# EAGLE design DIS08070H-V2.0-20231204 (EAGLE 9.5.1)
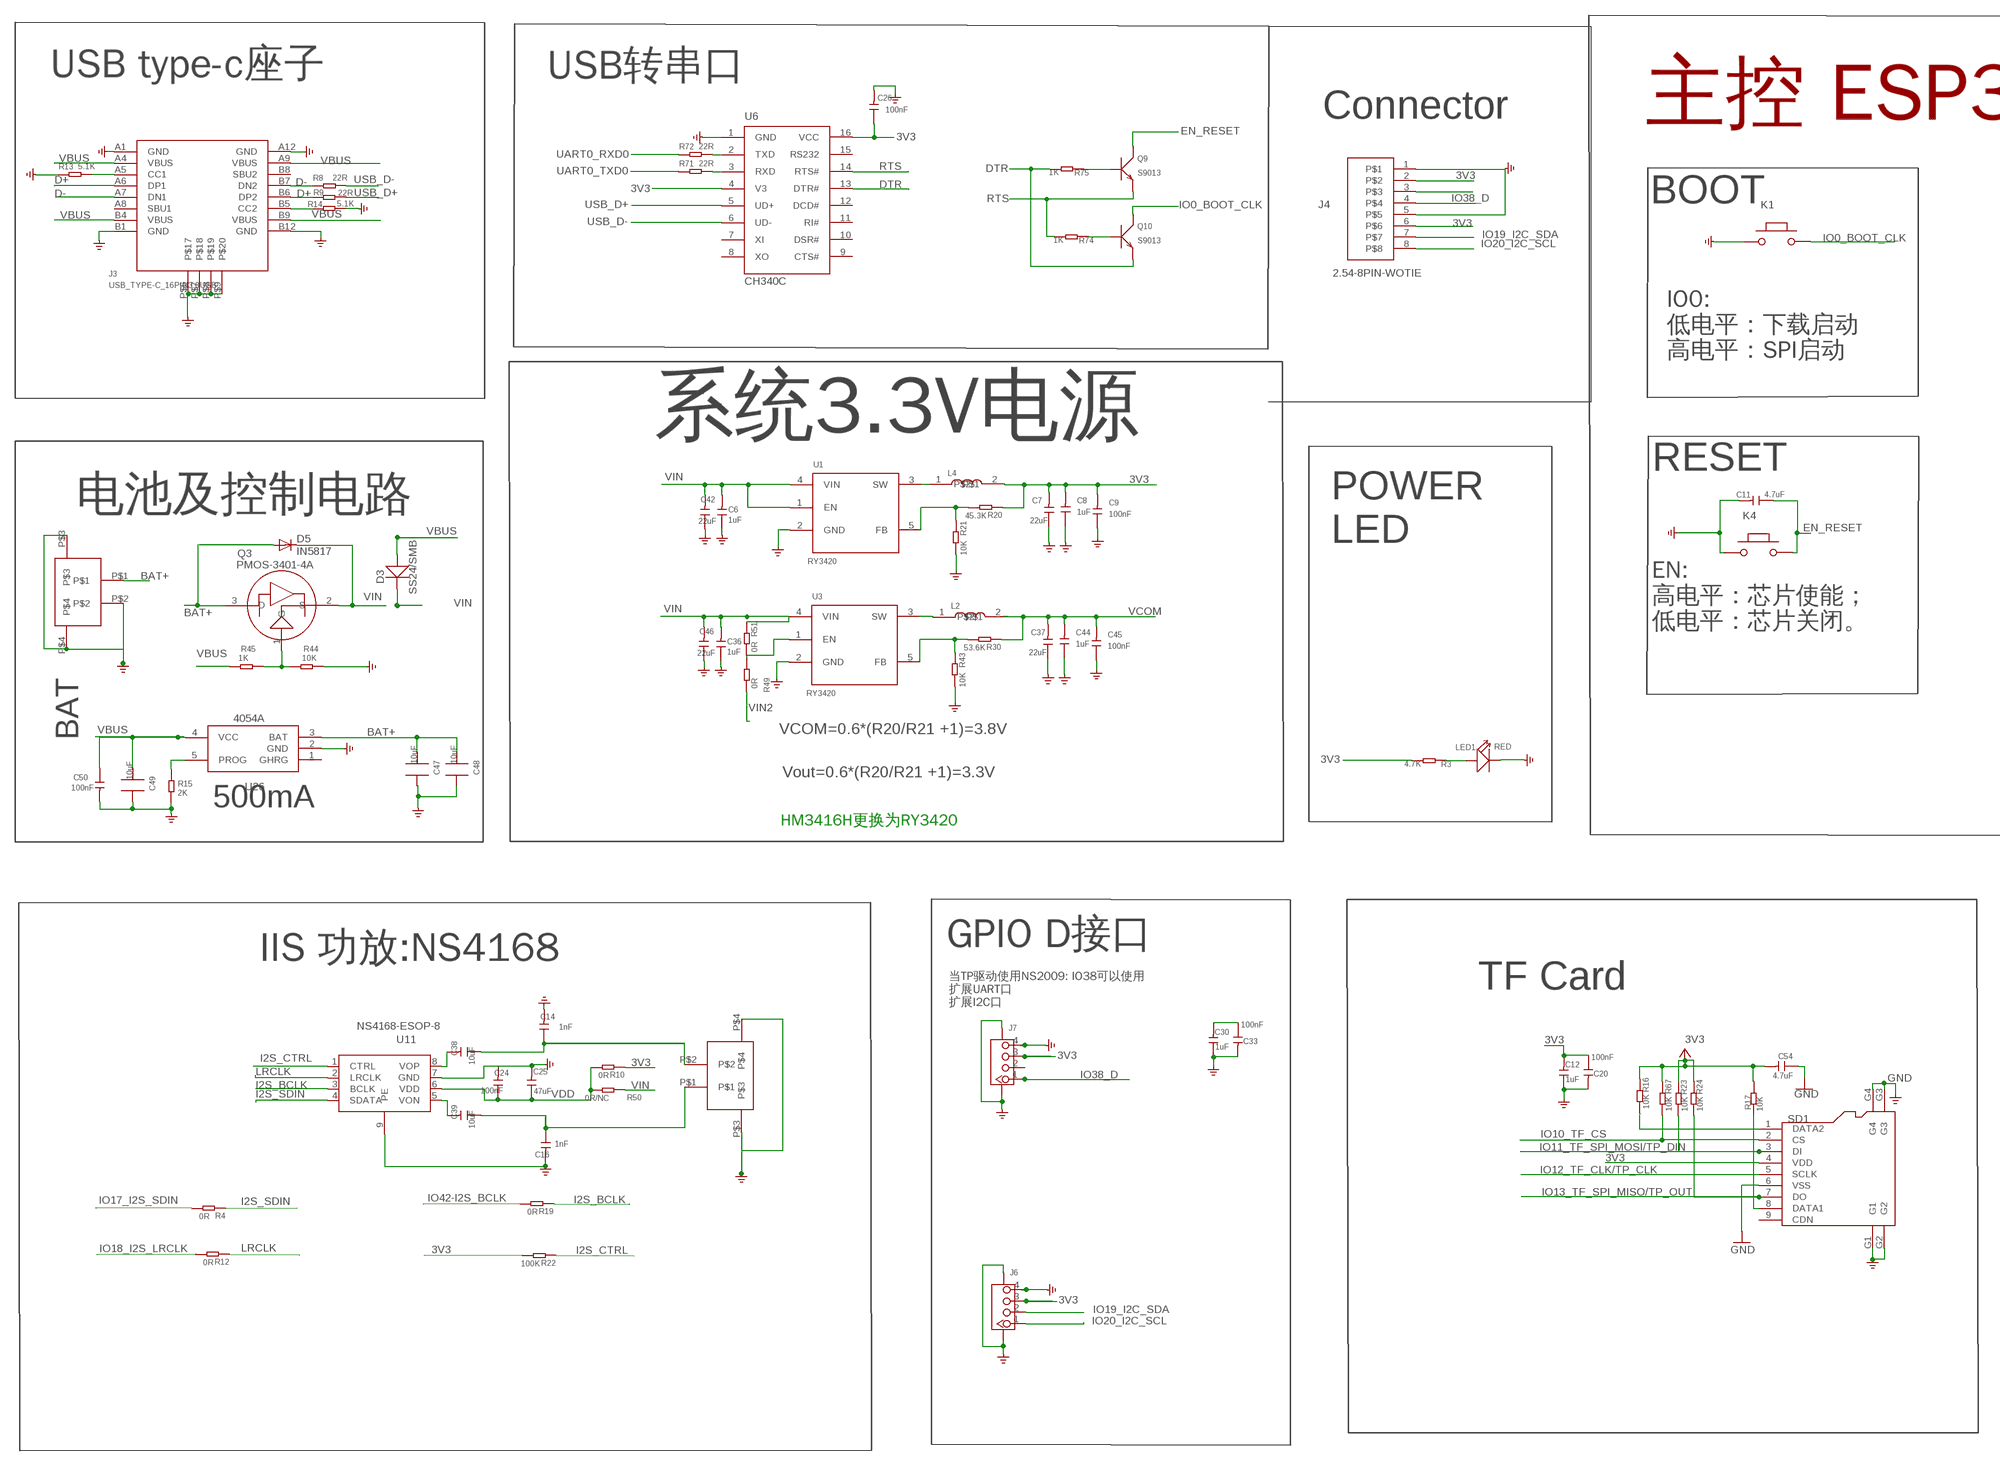
[diagram p0: schematic, sheet 1, part 1 of 2]
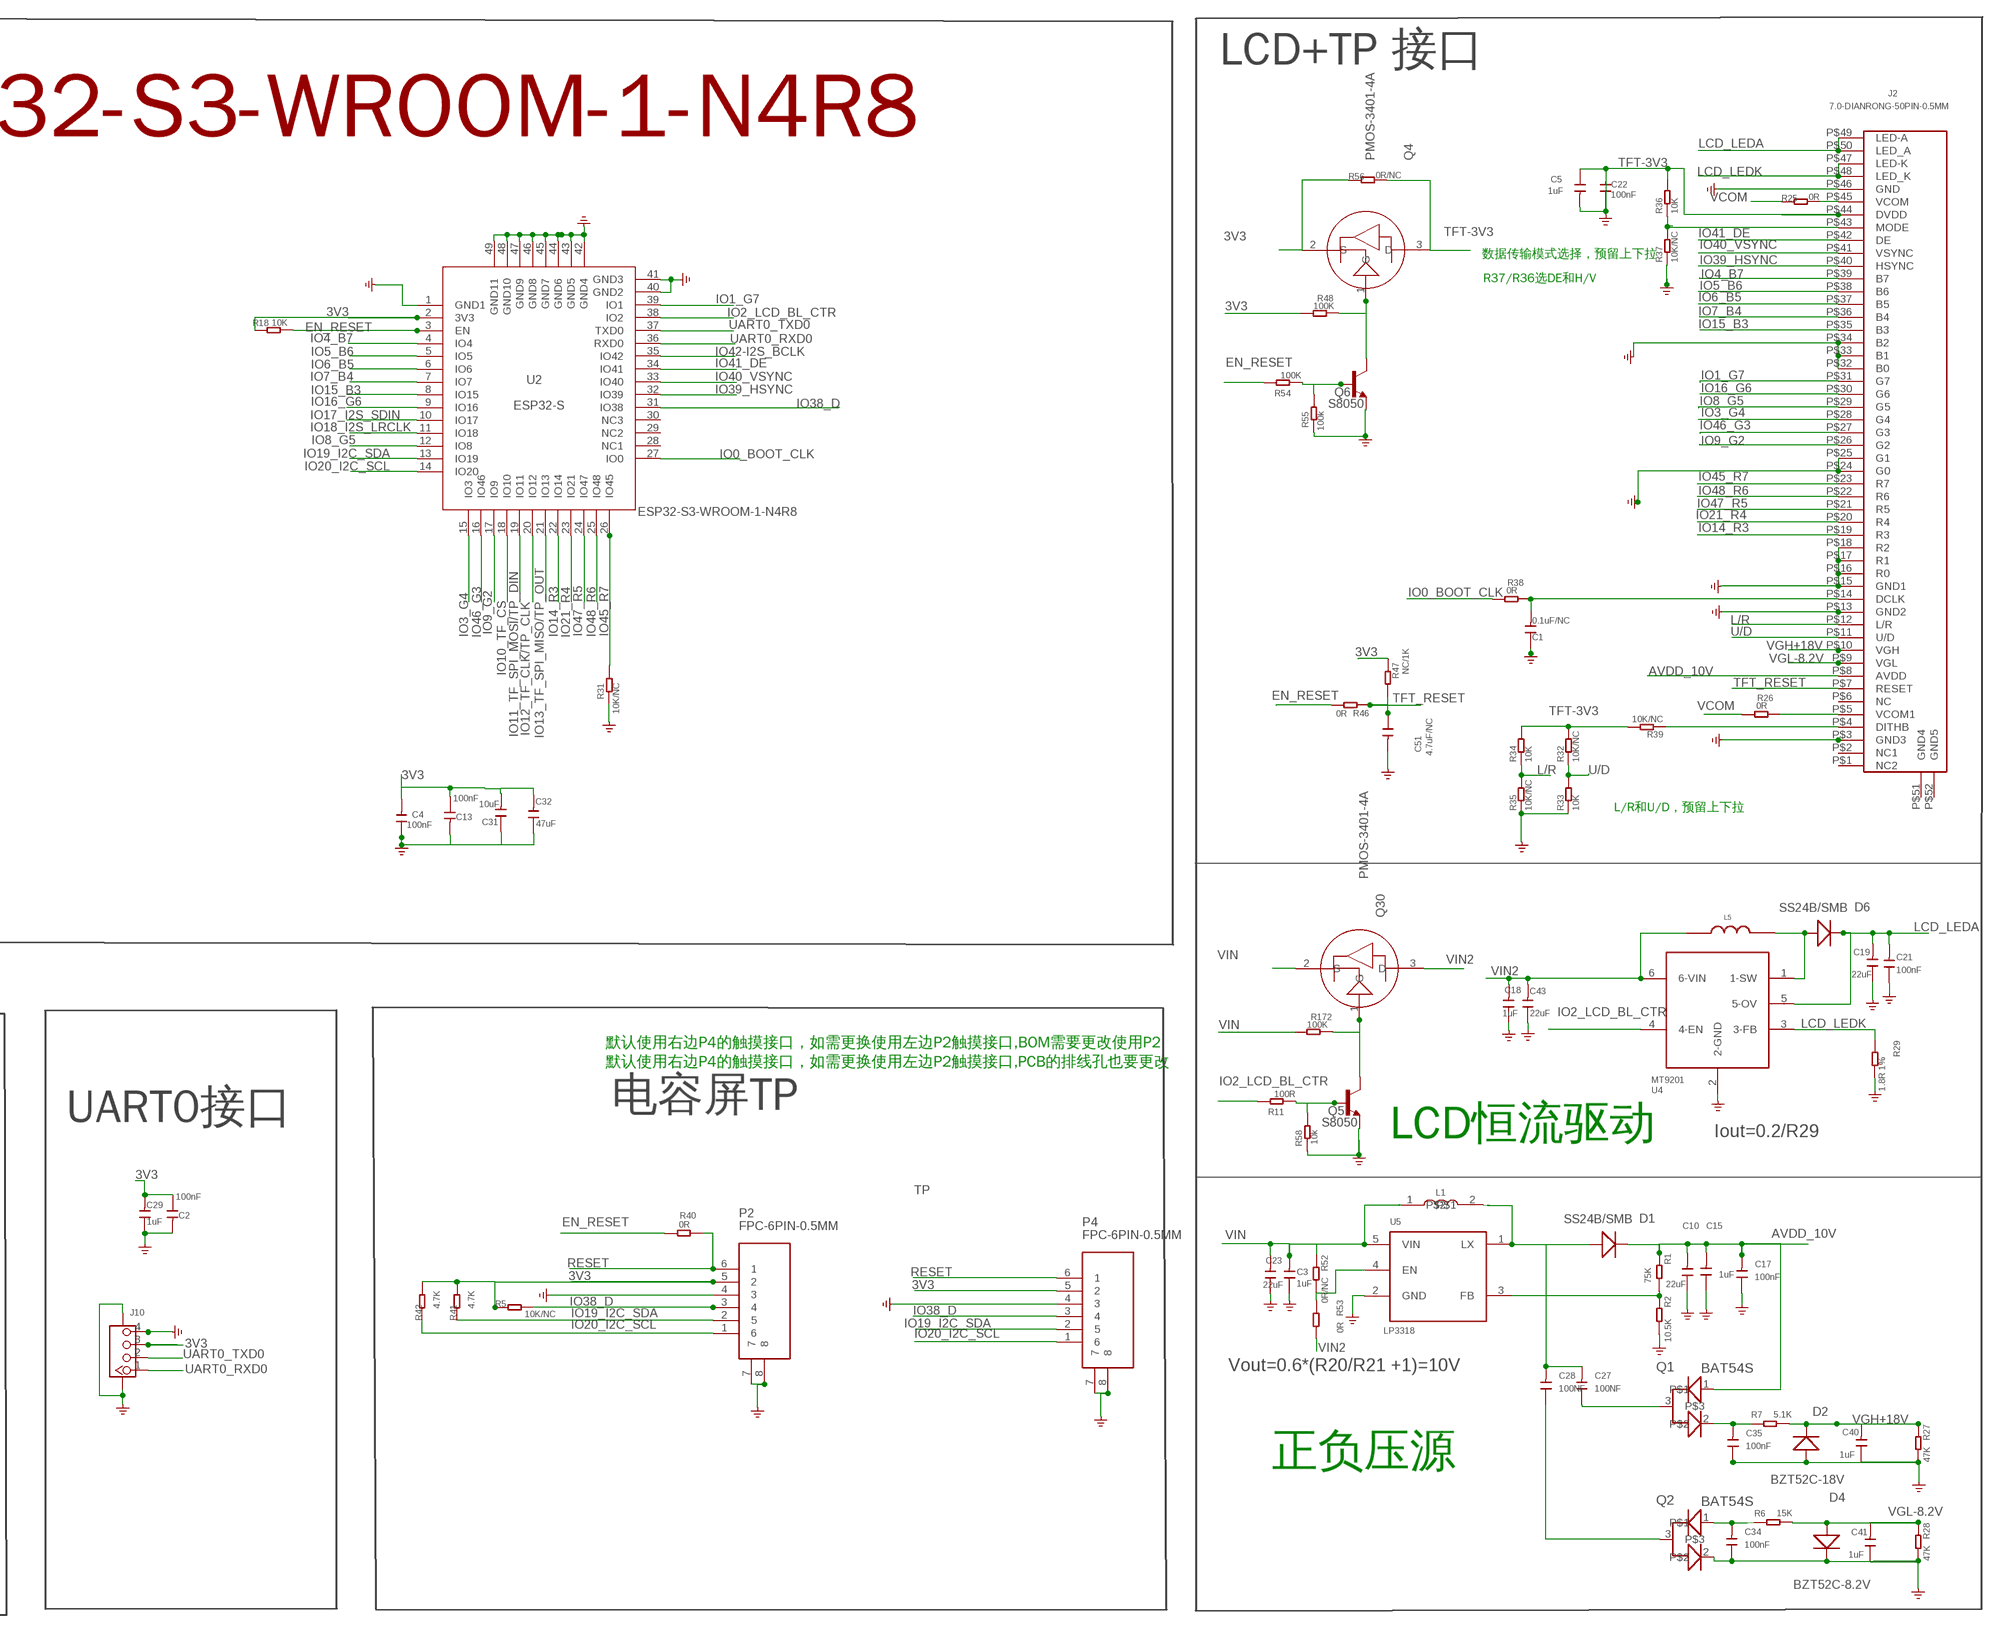
[diagram p1: schematic, sheet 1, part 2 of 2]

## Parts
C1  0.1uF/NC  DISCRETE_C-0603  [DISCRETE_C0603]
C2  100nF  C-0603  [C0603]
C3  1uF  C0603  [0603]
C4  100nF  C-0603  [C0603]
C5  1uF  C-0603  [C0603]
C6  1uF  C0603  [0603]
C7  22uF  C0805  [0805]
C8  1uF  C0603  [0603]
C9  100nF  C0603  [0603]
C10  22uF  C0805  [0805]
C11  4.7uF  C0603  [0603]
C12  1uF  DISCRETE_C-0603  [DISCRETE_C0603]
C13  100nF  C-0603  [C0603]
C14  1nF  C-0603  [C0603]
C15  1uF  C0603  [0603]
C16  1nF  C-0603  [C0603]
C17  100nF  C0603  [0603]
C18  1uF  C0603  [0603]
C19  22uF  C0805  [0805]
C20  100nF  C-0603  [C0603]
C21  100nF  C0603  [0603]
C22  100nF  C-0603  [C0603]
C23  22uF  C0805  [0805]
C24  100nF  C-0603  [C0603]
C25  47uF  C0805  [0805]
C26  100nF  C0603  [0603]
C27  100NF  C0603  [0603]
C28  100NF  C0603  [0603]
C29  1uF  DISCRETE_C-0603  [DISCRETE_C0603]
C30  1uF  DISCRETE_C-0603  [DISCRETE_C0603]
C31  10uF  DISCRETE_C-0603  [DISCRETE_C0603]
C32  47uF  C0805  [0805]
C33  100nF  C-0603  [C0603]
C34  100nF  C0603  [0603]
C35  100nF  C0603  [0603]
C36  1uF  C0603  [0603]
C37  22uF  C0805  [0805]
C38  10uF  C-0603  [C0603]
C39  10uF  C-0603  [C0603]
C40  1uF  C0805  [0805]
C41  1uF  C0805  [0805]
C42  22uF  C0805  [0805]
C43  22uF  C0805  [0805]
C44  1uF  C0603  [0603]
C45  100nF  C0603  [0603]
C46  22uF  C0805  [0805]
C47  10uF  C0805_S  [0805_S]
C48  10uF  C0805_S  [0805_S]
C49  10uF  C0805_S  [0805_S]
C50  100nF  C-0603  [C0603]
C51  4.7uF/NC  C0603  [0603]
C54  4.7uF  DISCRETE_C-0603  [DISCRETE_C0603]
D1  SS24B/SMB  214ABDO-214AB  [214AB]
D2  BZT52C-18V  DISCRETE_D1206  [DISCRETE_SOD123]
D3  SS24/SMB  214ABDO-214AB  [214AB]
D4  BZT52C-8.2V  DISCRETE_D1206  [DISCRETE_SOD123]
D5  IN5817  DIODE-DO-214AC  [DO-214AC]
D6  SS24B/SMB  214ABDO-214AB  [214AB]
J1  PH2.0WT-2PIN  [PH2.0WT-2PIN]
J2  7.0-DIANRONG-50PIN-0.5MM  [7.0-DAINRONG-50PIN-0.5MM]
J3  USB_TYPE-C_16PIN3.0USB  [KEVIN_3.0TYPEC-SMD]
J4  2.54-8PIN-WOTIE  [2.54-8P-WOTIE]
J5  PH2.0WT-2PIN  [PH2.0WT-2PIN]
J6  CONNECTOR_TWIG-4P-2.0-SMD-FEMALE-REINFORCE90D  [CONNECTOR_4P-SMD-2.0-90D]
J7  CONNECTOR_TWIG-4P-2.0-SMD-FEMALE-REINFORCE90D  [CONNECTOR_4P-SMD-2.0-90D]
J10  CONNECTOR_TWIG-4P-2.0-SMD-FEMALE-REINFORCE90D  [CONNECTOR_4P-SMD-2.0-90D]
K1  BUTTON  PB157  [157SW]
K4  BUTTON  PB157  [157SW]
L1  L-0530  [CD54_CD54]
L2  L-0530  [CD54_CD54]
L4  L-0530  [CD54_CD54]
L5  CD32_6.8uH  CD32_950MA  [CD32]
LED1  RED  DISCRETE_LED0603  [DISCRETE_LED-0603]
P2  FPC-6PIN-0.5MM  [FPC-6PIN-0.5MM]
P4  FPC-6PIN-0.5MM  [FPC-6PIN-0.5MM]
Q1  BAT54S  [SOT23-3]
Q2  BAT54S  [SOT23-3]
Q3  PMOS-3401-4A  P-MOS-SOT23  [SOT-23]
Q4  PMOS-3401-4A  P-MOS-SOT23  [SOT-23]
Q5  S8050  SPARKFUN_TRANSISTOR_NPNSOT23  [SPARKFUN_SOT23]
Q6  S8050  SPARKFUN_TRANSISTOR_NPNSOT23  [SPARKFUN_SOT23]
Q9  S9013  TRANSISTOR-NPN-SOT23  [SOT23@1]
Q10  S9013  TRANSISTOR-NPN-SOT23  [SOT23@1]
Q30  PMOS-3401-4A  P-MOS-SOT23  [SOT-23]
R1  75K  DISCRETE_R-0603  [DISCRETE_R0603]
R2  10.5K  DISCRETE_R-0603  [DISCRETE_R0603]
R3  4.7K  DISCRETE_R-0603  [DISCRETE_R0603]
R4  0R  DISCRETE_R-0603  [DISCRETE_R0603]
R5  10K/NC  DISCRETE_R-0603  [DISCRETE_R0603]
R6  15K  DISCRETE_R-0603  [DISCRETE_R0603]
R7  5.1K  DISCRETE_R-0603  [DISCRETE_R0603]
R8  22R  DISCRETE_R-0603  [DISCRETE_R0603]
R9  22R  DISCRETE_R-0603  [DISCRETE_R0603]
R10  0R  DISCRETE_R-0603  [DISCRETE_R0603]
R11  100R  R0603  [R0603]
R12  0R  DISCRETE_R-0603  [DISCRETE_R0603]
R13  5.1K  DISCRETE_R-0603  [DISCRETE_R0603]
R14  5.1K  DISCRETE_R-0603  [DISCRETE_R0603]
R15  2K  DISCRETE_R-0603  [DISCRETE_R0603]
R16  10K  DISCRETE_R-0603  [DISCRETE_R0603]
R17  10K  DISCRETE_R-0603  [DISCRETE_R0603]
R18  10K  DISCRETE_R-0603  [DISCRETE_R0603]
R19  0R  DISCRETE_R-0603  [DISCRETE_R0603]
R20  45.3K  DISCRETE_R-0603  [DISCRETE_R0603]
R21  10K  DISCRETE_R-0603  [DISCRETE_R0603]
R22  100K  DISCRETE_R-0603  [DISCRETE_R0603]
R23  10K  DISCRETE_R-0603  [DISCRETE_R0603]
R24  10K  DISCRETE_R-0603  [DISCRETE_R0603]
R25  0R  DISCRETE_R-0603  [DISCRETE_R0603]
R26  0R  R-0603  [R0603]
R27  47K  DISCRETE_R-0603  [DISCRETE_R0603]
R28  47K  DISCRETE_R-0603  [DISCRETE_R0603]
R29  1.8R 1%  DISCRETE_R-0603  [DISCRETE_R0603]
R30  53.6K  DISCRETE_R-0603  [DISCRETE_R0603]
R31  10K/NC  R0603  [R0603]
R32  10K/NC  DISCRETE_R-0603  [DISCRETE_R0603]
R33  10K  DISCRETE_R-0603  [DISCRETE_R0603]
R34  10K  DISCRETE_R-0603  [DISCRETE_R0603]
R35  10K/NC  DISCRETE_R-0603  [DISCRETE_R0603]
R36  10K  DISCRETE_R-0603  [DISCRETE_R0603]
R37  10K/NC  DISCRETE_R-0603  [DISCRETE_R0603]
R38  0R  R-0603  [R0603]
R39  10K/NC  DISCRETE_R-0603  [DISCRETE_R0603]
R40  0R  R-0603  [R0603]
R41  4.7K  DISCRETE_R-0603  [DISCRETE_R0603]
R42  4.7K  DISCRETE_R-0603  [DISCRETE_R0603]
R43  10K  DISCRETE_R-0603  [DISCRETE_R0603]
R44  10K  DISCRETE_R-0603  [DISCRETE_R0603]
R45  1K  DISCRETE_R-0603  [DISCRETE_R0603]
R46  0R  DISCRETE_R-0603  [DISCRETE_R0603]
R47  NC/1K  DISCRETE_R-0603  [DISCRETE_R0603]
R48  100K  R-0603  [R0603]
R49  0R  DISCRETE_R-0603  [DISCRETE_R0603]
R50  0R/NC  DISCRETE_R-0603  [DISCRETE_R0603]
R51  0R  DISCRETE_R-0603  [DISCRETE_R0603]
R52  0R/NC  DISCRETE_R-0603  [DISCRETE_R0603]
R53  0R  DISCRETE_R-0603  [DISCRETE_R0603]
R54  100K  R0603  [R0603]
R55  100k  R0603  [R0603]
R56  0R/NC  DISCRETE_R-0603  [DISCRETE_R0603]
R58  10k  R0603  [R0603]
R67  10K  DISCRETE_R-0603  [DISCRETE_R0603]
R71  22R  DISCRETE_R-0603  [DISCRETE_R0603]
R72  22R  DISCRETE_R-0603  [DISCRETE_R0603]
R74  1K  DISCRETE_R-0603  [DISCRETE_R0603]
R75  1K  DISCRETE_R-0603  [DISCRETE_R0603]
R172  100K  R-0603  [R0603]
SD1  HOLDER-MICROSD-9P  [9P-SMD-W/-RING]
U1  RY3420  A_XBJ_HM3420B  [A_XBJ_SOT23-5]
U2  ESP32-S  [ESP32-S3]
U3  RY3420  A_XBJ_HM3420B  [A_XBJ_SOT23-5]
U4  MT9201  [SOT23-6]
U5  LP3318  [LP3318_SOT23-5]
U6  CH340C  CH340G  [SOP-16]
U11  NS4168-ESOP-8  [NS4168-ESOP-8]
U26  4054A  [SOP23-5]

## Nets
3V3: C2.1 C4.2 C7.2 C8.2 C9.2 C12.2 C13.1 C20.1 C26.1 C29.2 C30.2 C31.2 C32.2 C33.1 C54.2 J4.2 J4.6 J6.3 J7.3 J10.3 L4.2 P2.5 P4.5 Q4.2(S) R3.2 R5.1 R10.1 R16.1 R17.1 R18.1 R20.1 R22.2 R23.1 R24.1 R41.2 R42.2 R47.2 R48.1 R56.1 R67.1 SD1.4(VDD) U2.2(3V3) U6.4(V3) U6.16(VCC) ; supply symbol labelled +3V3
AVDD_10V: C10.2 C15.2 C17.2 D1.2(-) J2.P$8(AVDD) Q1.1 R1.1
BAT+: C47.2 C48.2 D5.A J1.P$1 Q3.3(D) U26.3(BAT)
D+: J3.A6(DP1) J3.B6(DP2) R9.1
D-: J3.A7(DN1) J3.B7(DN2) R8.1
DCLK1: C1.2 J2.P$14(DCLK) R38.2
DTR: Q10.2(E) R75.2 U6.13(DTR#)
EN_RESET: C11.1 K4.2 Q9.3(C) R18.2 R40.1 R46.2 R54.2 U2.3(EN)
GND: C1.1 C2.2 C3.1 C4.1 C5.2 C6.1 C7.1 C8.1 C9.1 C10.1 C11.2 C12.1 C13.2 C14.2 C15.1 C16.2 C17.1 C18.1 C19.1 C20.2 C21.1 C22.1 C23.1 C24.2 C25.2 C26.2 C29.1 C30.1 C31.1 C32.1 C33.2 C34.1 C35.1 C36.1 C37.1 C40.1 C41.1 C42.1 C43.1 C44.1 C45.1 C46.1 C47.1 C48.1 C49.1 C50.2 C51.2 C54.1 D2.+ D4.- J1.P$2 J1.P$3 J1.P$4 J2.P$3(GND3) J2.P$13(GND2) J2.P$15(GND1) J2.P$16(R0) J2.P$17(R1) J2.P$18(R2) J2.P$24(G0) J2.P$25(G1) J2.P$32(B0) J2.P$33(B1) J2.P$34(B2) J2.P$46(GND) J3.A1(GND) J3.A12(GND) J3.B1(GND) J3.B12(GND) J3.P$6 J3.P$7 J3.P$8 J3.P$9 J4.1 J4.5 J5.P$3 J5.P$4 J6.4 J6.SS1 J6.SS2 J7.4 J7.SS1 J7.SS2 J10.4 J10.SS1 J10.SS2 K1.1 K4.1 LED1.- P2.4 P2.7 P2.8 P4.4 P4.7 P4.8 Q2.2 Q5.2(E) Q6.2(E) R2.2 R13.1 R14.2 R15.2 R21.2 R27.2 R28.2 R29.2 R31.1 R33.1 R35.1 R37.1 R43.2 R44.1 R55.1 R58.1 SD1.6(VSS) SD1.G1 SD1.G2 SD1.G3 SD1.G4 U1.2(GND) U2.1(GND1) U2.40(GND2) U2.41(GND3) U2.42(GND4) U2.43(GND5) U2.44(GND6) U2.45(GND7) U2.46(GND8) U2.47(GND9) U2.48(GND10) U2.49(GND11) U3.2(GND) U4.2(2-GND) U5.2(GND) U6.1(GND) U11.7(GND) U11.9(PE) U26.2(GND)
I2S_BCLK: R19.1 U11.3(BCLK)
I2S_CTRL: R22.1 U11.1(CTRL)
I2S_SDIN: R4.1 U11.4(SDATA)
IO0_BOOT_CLK: K1.2 Q10.3(C) R38.1 U2.27(IO0)
IO1_G7: J2.P$31(G7) U2.39(IO1)
IO2_LCD_BL_CTR: R11.2 U2.38(IO2) U4.4(4-EN)
IO3_G4: J2.P$28(G4) U2.15(IO3)
IO4_B7: J2.P$39(B7) U2.4(IO4)
IO5_B6: J2.P$38(B6) U2.5(IO5)
IO6_B5: J2.P$37(B5) U2.6(IO6)
IO7_B4: J2.P$36(B4) U2.7(IO7)
IO8_G5: J2.P$29(G5) U2.12(IO8)
IO9_G2: J2.P$26(G2) U2.17(IO9)
IO10_TF_CS: R67.2 SD1.2(CS) U2.18(IO10)
IO11_TF_SPI_MOSI/TP_DIN: R23.2 SD1.3(DI) U2.19(IO11)
IO12_TF_CLK/TP_CLK: SD1.5(SCLK) U2.20(IO12)
IO13_TF_SPI_MISO/TP_OUT: R24.2 SD1.7(DO) U2.21(IO13)
IO14_R3: J2.P$19(R3) U2.22(IO14)
IO15_B3: J2.P$35(B3) U2.8(IO15)
IO16_G6: J2.P$30(G6) U2.9(IO16)
IO17_I2S_SDIN: R4.2 U2.10(IO17)
IO18_I2S_LRCLK: R12.2 U2.11(IO18)
IO19_I2C_SDA: J4.7 J6.2 P2.2 P4.2 R41.1 U2.13(IO19)
IO20_I2C_SCL: J4.8 J6.1 P2.1 P4.1 R42.1 U2.14(IO20)
IO21_R4: J2.P$20(R4) U2.23(IO21)
IO38_D: J4.4 J7.1 P2.3 P4.3 R5.2 U2.31(IO38)
IO39_HSYNC: J2.P$40(HSYNC) U2.32(IO39)
IO40_VSYNC: J2.P$41(VSYNC) U2.33(IO40)
IO41_DE: J2.P$42(DE) U2.34(IO41)
IO42-I2S_BCLK: R19.2 U2.35(IO42)
IO45_R7: J2.P$23(R7) R31.2 U2.26(IO45)
IO46_G3: J2.P$27(G3) U2.16(IO46)
IO47_R5: J2.P$21(R5) U2.24(IO47)
IO48_R6: J2.P$22(R6) U2.25(IO48)
L/R: J2.P$12(L/R) R34.1 R35.2
LCD_LEDA: C19.2 C21.2 D6.2(-) J2.P$49(LED-A) J2.P$50(LED_A) U4.5(5-OV)
LCD_LEDK: J2.P$47(LED-K) J2.P$48(LED_K) R29.1 U4.3(3-FB)
LRCLK: R12.1 U11.2(LRCLK)
N$1: LED1.+ R3.1
N$2: J2.P$45(VCOM) R25.2
N$3: C14.1 C38.1 J5.P$2
N$4: J2.P$5(VCOM1) R26.2
N$6: C38.2 U11.8(VOP)
N$7: R1.2 R2.1 U5.3(FB)
N$8: C39.2 U11.5(VON)
N$9: C27.2 C28.2 D1.1(+) L1.2 U5.1(LX)
N$10: C27.1 Q1.3
N$11: J3.A5(CC1) R13.2
N$12: J2.P$43(MODE) R36.1 R37.2
N$13: L4.1 U1.3(SW)
N$14: J2.P$4(DITHB) R39.1
N$15: C16.1 C39.1 J5.P$1
N$16: D6.1(+) L5.2 U4.1(1-SW)
N$17: J3.B5(CC2) R14.1
N$18: R30.2 R43.1 U3.5(FB)
N$19: L2.1 U3.3(SW)
N$20: R20.2 R21.1 U1.5(FB)
N$21: Q3.1(G) R44.2 R45.1
N$22: R15.1 U26.5(PROG)
N$23: Q5.1(B) R11.1 R58.2
N$24: C28.1 Q2.3
N$26: R49.1 R51.2 U3.1(EN)
N$27: Q4.1(G) Q6.3(C) R48.2
N$28: J4.3
N$29: C35.2 Q1.2 R7.1
N$30: C34.2 Q2.1 R6.1
N$31: R52.2 R53.1 U5.4(EN)
N$32: Q9.1(B) R75.1
N$33: Q6.1(B) R54.1 R55.2
N$36: Q5.3(C) Q30.1(G) R172.2
N$38: Q10.1(B) R74.1
N$40: R72.2 U6.2(TXD)
N$42: R71.2 U6.3(RXD)
N$47: R16.2 SD1.1(DATA2)
N$48: R17.2 SD1.8(DATA1)
RESET: P2.6 P4.6 R40.2
RTS: Q9.2(E) R74.2 U6.14(RTS#)
TFT-3V3: C5.1 C22.2 J2.P$44(DVDD) Q4.3(D) R32.2 R34.2 R36.2 R39.2 R56.2
TFT_RESET: C51.1 J2.P$7(RESET) R46.1 R47.1
U/D: J2.P$11(U/D) R32.1 R33.2
UART0_RXD0: J10.1 R72.1 U2.36(RXD0)
UART0_TXD0: J10.2 R71.1 U2.37(TXD0)
USB_D+: R9.2 U6.5(UD+)
USB_D-: R8.2 U6.6(UD-)
VBUS: C49.2 C50.1 D3.1(+) J3.A4(VBUS) J3.A9(VBUS) J3.B4(VBUS) J3.B9(VBUS) R45.2 U26.4(VCC)
VCOM: C37.2 C44.2 C45.2 L2.2 R25.1 R26.1 R30.1
VDD: C24.1 C25.1 R10.2 R50.2 U11.6(VDD)
VGH+18V: C40.2 D2.- J2.P$10(VGH) R7.2 R27.1
VGL-8.2V: C41.2 D4.+ J2.P$9(VGL) R6.2 R28.1
VIN: C3.2 C6.2 C23.2 C36.2 C42.2 C46.2 D3.2(-) D5.C L1.1 Q3.2(S) Q30.2(S) R50.1 R51.1 R52.1 R172.1 U1.1(EN) U1.4(VIN) U3.4(VIN) U5.5(VIN)
VIN2: C18.2 C43.2 L5.1 Q30.3(D) R49.2 R53.2 U4.6(6-VIN)
Unconnected: J2.P$1(NC2) J2.P$2(NC1) J2.P$6(NC) J2.P$51(GND4) J2.P$52(GND5) J3.A8(SBU1) J3.B8(SBU2) J7.2 SD1.9(CDN) U2.28(NC1) U2.29(NC2) U2.30(NC3) U6.7(XI) U6.8(XO) U6.9(CTS#) U6.10(DSR#) U6.11(RI#) U6.12(DCD#) U6.15(RS232) U26.1(GHRG)

## Notes on the sheet
- LCD+TP 接口
- USB type-c座子 | USB转串口
- Connector | 主控 ESP32-S3-WROOM-1-N4R8
- BOOT
- 数据传输模式选择，预留上下拉
- R37/R36选DE和H/V
- IO0:
  低电平：下载启动
  高电平：SPI启动
- 系统3.3V电源
- RESET
- 电池及控制电路
- POWER
  LED
- EN:
  高电平：芯片使能；
  低电平：芯片关闭。
- L/R和U/D，预留上下拉
- VCOM=0.6*(R20/R21 +1)=3.8V
- BAT
- Vout=0.6*(R20/R21 +1)=3.3V
- 500mA
- HM3416H更换为RY3420
- 默认使用右边P4的触摸接口，如需更换使用左边P2触摸接口,BOM需要更改使用P2
- GPIO D接口 | 默认使用右边P4的触摸接口，如需更换使用左边P2触摸接口,PCB的排线孔也要更改
- IIS 功放:NS4168
- TF Card | UART0接口 | 电容屏TP
- 当TP驱动使用NS2009: IO38可以使用
  扩展UART口
  扩展I2C口
- LCD恒流驱动 | Iout=0.2/R29
- TP
- Vout=0.6*(R20/R21 +1)=10V
- 正负压源

## Library data of the parts
C1 C31 C54 = A9G:DISCRETE_C*: Ceramic Capacitors
C2 C4 C5 C13 C14 C16 C20 C22 C24 C33 C38 C39 C50 = discrete:C*: Ceramic Capacitors
C3 C6 C8 C9 C11 C15 C17 C18 C21 C26-C28 C34-C36 C44 C45 C51 = A_xbj:C0603
C7 C10 C19 C23 C25 C32 C37 C40-C43 C46 = A_xbj:C0805
C12 C29 C30 = A_xbj:DISCRETE_C*: Ceramic Capacitors
C47-C49 = CPT_SMD:C0805
D1 D3 D6 = DO-214AB:214AB: 214AB
D2 D4 = cooper:DISCRETE_D*
D5 = diode:DIODE-: DIODE
J1 J5 = cooper:PH2.0WT-2PIN
J2 = cooper:7.0-DIANRONG-50PIN-0.5MM
J3 = WZ3532R024-ESP32-V0.1-20221226:USB_TYPE-C_16PIN
J4 = cooper:2.54-8PIN-WOTIE
J6 J7 J10 = A_xbj:CONNECTOR_TWIG-4P-2.0-SMD-FEMALE-REINFORCE
K1 K4 = MySMD:PB157
L1 L2 L4 = WZ2432R028-ESP32-V1.2-20231108:L-0530
L5 = CD54:CD32_950MA
LED1 = A_xbj:DISCRETE_LED*
P2 P4 = cooper:FPC-6PIN-0.5MM
Q1 Q2 = cooper:BAT54S
Q3 Q4 Q30 = DFN8:P-MOS-SOT23
Q5 Q6 = Adafruit_HUZZAH32_ESP32_Feather:SPARKFUN_TRANSISTOR_NPN: Transistor NPN BJT configuration in SOT23 package. MMBT2222 is the common NPN we use. Double check BCE configuration again layout.
Q9 Q10 = discrete:TRANSISTOR-NPN*: NPN audion
R1-R10 R12-R14 R16-R25 R27-R30 R41-R43 R46 R47 R49-R53 R56 R67 R71 R72 R74 R75 = Crowtail-_LED-V2.0-20190615-01:DISCRETE_R*
R11 R31 R54 R55 R58 = cooper:R0603
R15 R32-R37 R39 R44 R45 = A9G:DISCRETE_R*
R26 R38 R40 R48 R172 = discrete:R*
SD1 = Connector:HOLDER-MICROSD-9P
U1 U3 = CrowBot_-V1.0-20220525:A_XBJ_HM3420B
U2 = DW1000:ESP32-S; U2: ESP32-S3-WROOM-1-N4R8
U4 = cooper:MT9201
U5 = cooper:LP3318
U6 = A_xbj:CH340G
U11 = STC_MCUSTC8G1K08A:NS4168-ESOP-8
U26 = DFN8:4054A

## Net classes
0 default: width 0.152 mm, drill 0.305 mm, clearance 0.203 mm

## Board
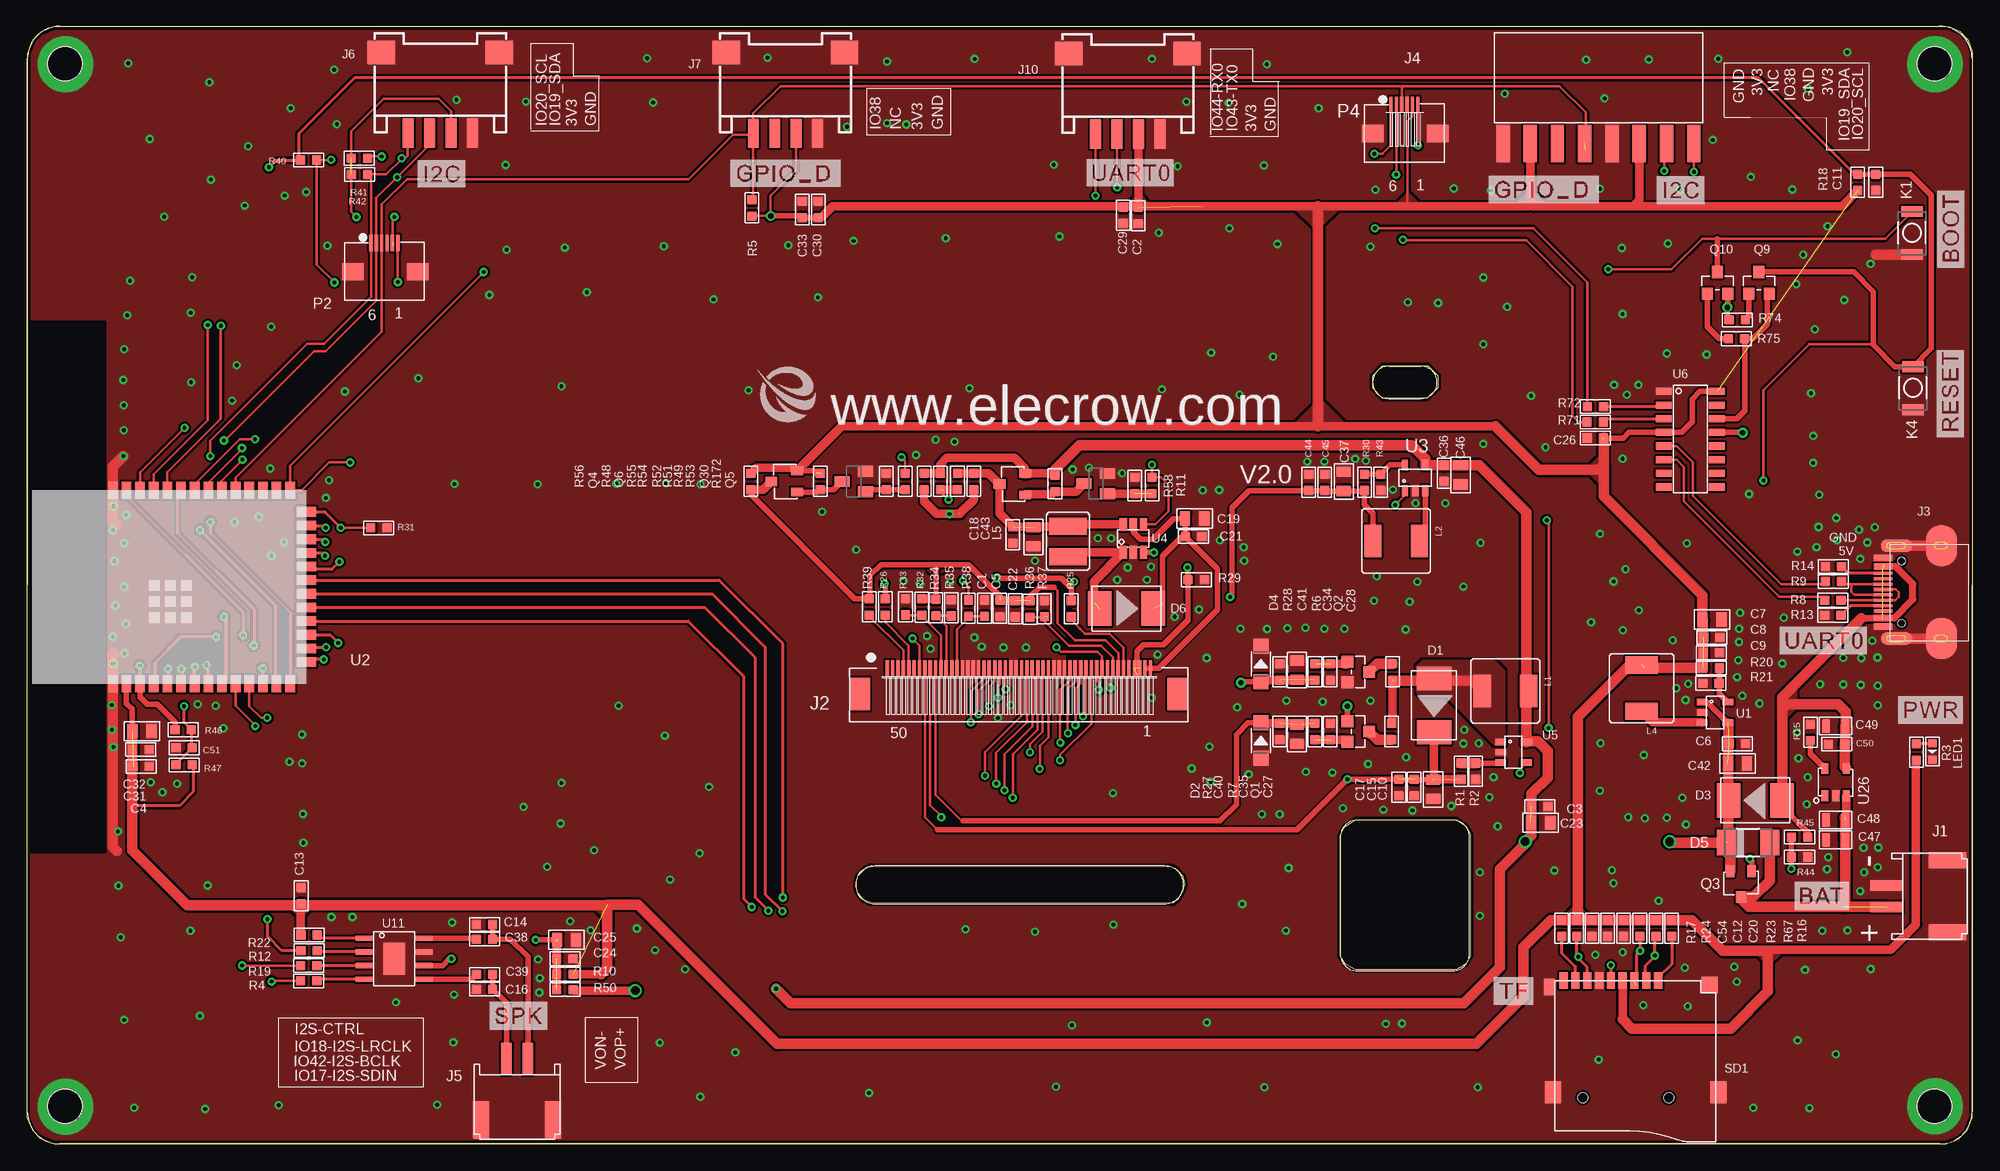
[diagram p2: board, top side]
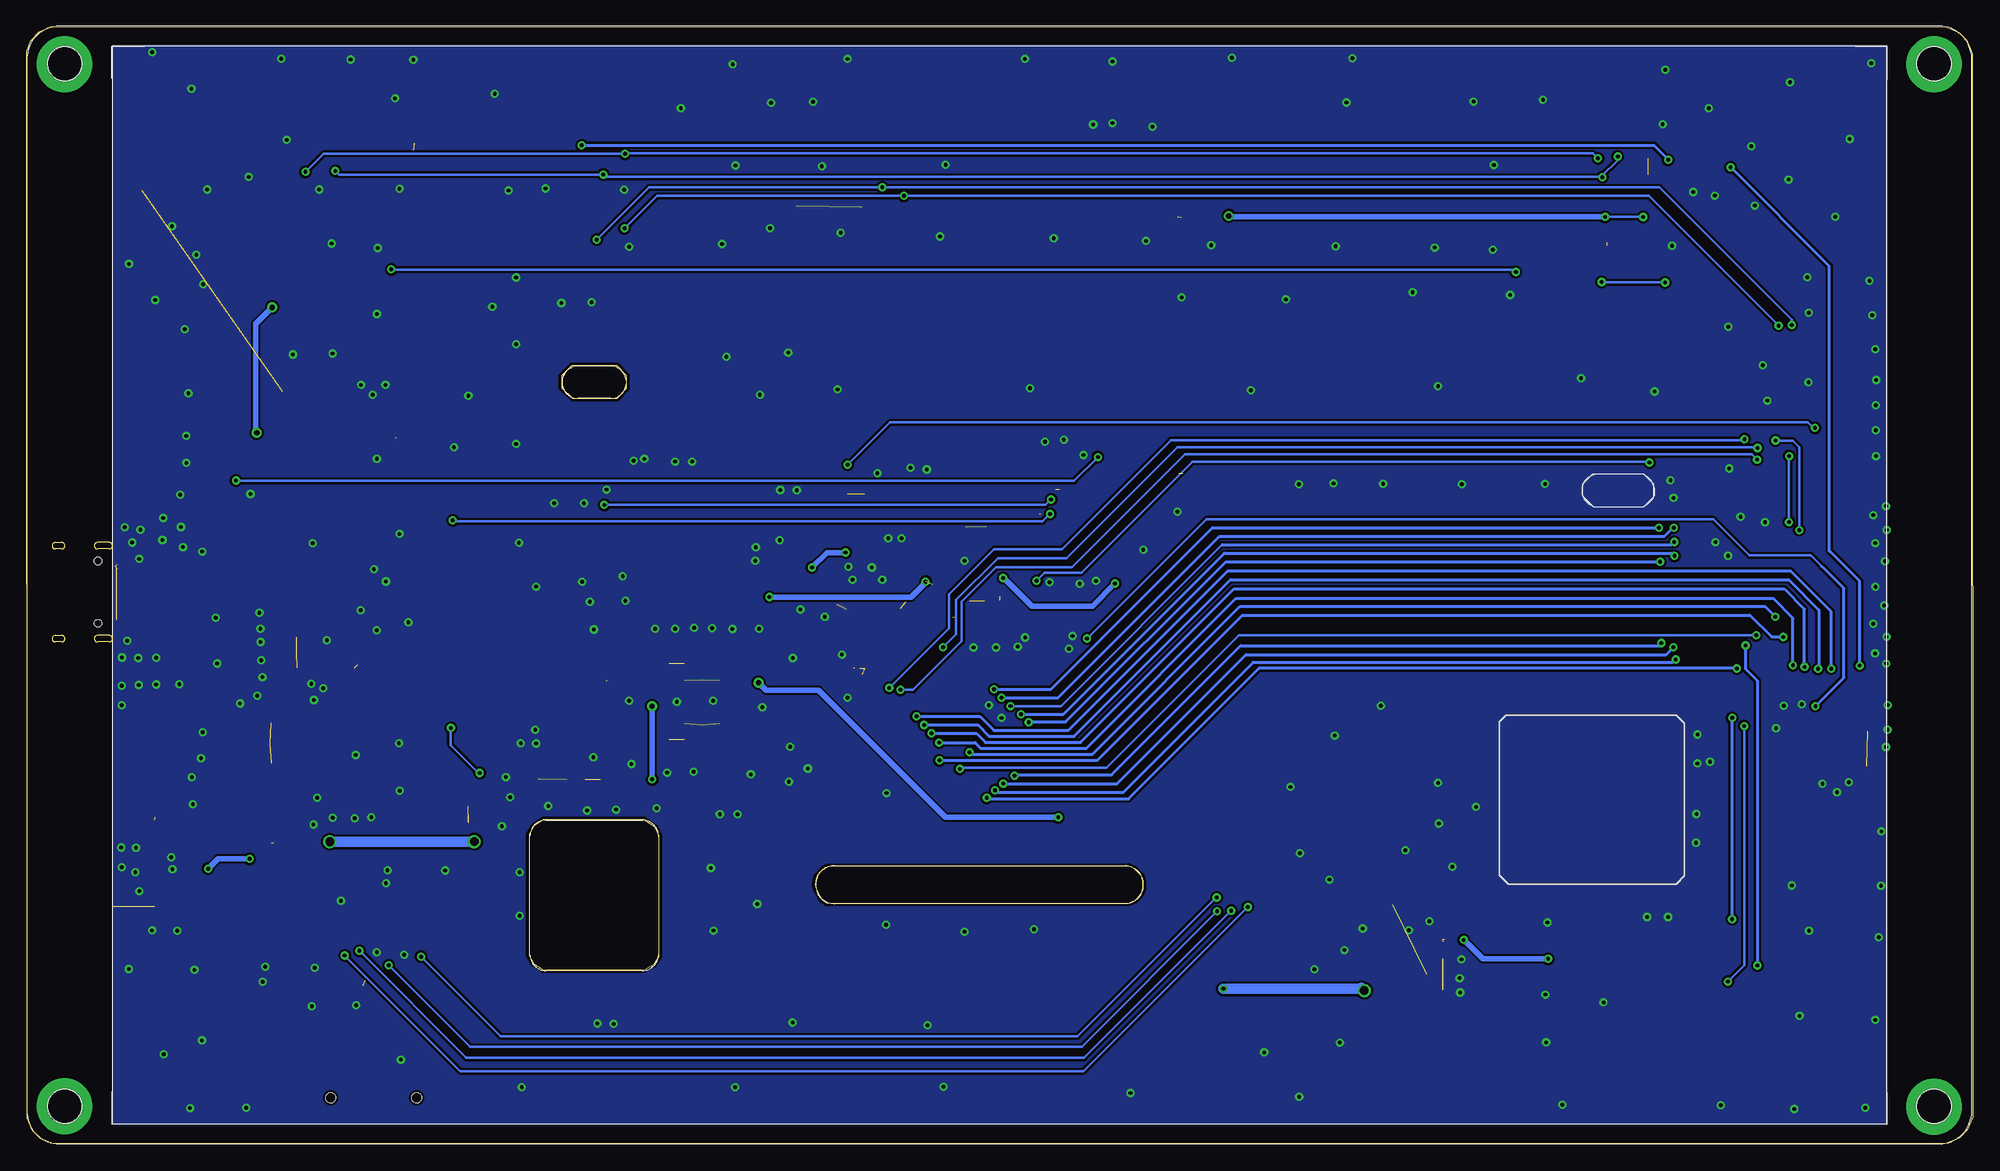
[diagram p3: board, bottom side, seen from below]

Size 181.1 x 103.94 mm. Coordinates in mm from the lower left corner, seen from the top.
Outline: 106.62,22.39 78.53,22.41 77.85,22.73 77.78,22.82 77.43,23.28 77.32,23.44 77.22,23.8 77.22,24.4 77.35,24.93 78.03,25.61 78.54,25.82 106.55,25.79 106.87,25.63 107.12,25.43 107.54,24.96 107.7,24.5 107.75,24.11 107.57,23.51 107.13,22.78 106.62,22.39
Outline: 178.83,103.94 2.42,103.91 1.28,103.44 0.54,102.7 0.03,101.45 0,2.48 0.48,1.32 1.26,0.54 2.57,0 178.63,0 179.81,0.49 180.61,1.29 181.08,2.41 181.1,101.63 180.75,102.66 179.93,103.48 178.83,103.94
Outline: 133.07,16.19 123.66,16.19 122.71,16.7 122.24,17.48 122.24,28.74 122.64,29.47 123.66,30.14 133.07,30.14 133.93,29.56 134.33,28.81 134.33,17.51 133.93,16.77 133.07,16.19
Outline: 125.26,70.29 125.26,71.46 126.18,72.39 130.38,72.39 131.31,71.46 131.31,70.37 130.3,69.36 126.18,69.36 125.26,70.29
Copper layers (1*16): Top 0.035mm / dielectric 1.5mm / Bottom 0.035mm
Design rules "default *": minimum track width 10mil, minimum drill 0.35mm, track to track 8mil, track to pad 7mil, pad to pad 7mil, via to via 8mil, smd to smd 10mil, copper to edge 10mil, drill to drill 8mil, minimum pad ring 10mil, minimum via ring 8mil, stop-mask expansion 4mil, vias tented up to drill 100mil, thermal gap 0mil

### Footprints (pad centres in the part's own frame; a part is rotated, then mirrored left to right if it is on the bottom)
DISCRETE_C0603 = smd 0.889 x 0.889: 1 -0.762,0; 2 0.762,0
C0603 = smd 0.889 x 0.889: 1 -0.762,0; 2 0.762,0
0603 = smd 0.889 x 0.889: 1 -0.762,0; 2 0.762,0
0805 = smd 1.016 x 1.397: 1 -0.889,0; 2 0.889,0
0805_S = smd 0.762 x 1.27: 1 -0.889,0; 2 0.889,0
214AB = smd 2.2 x 3.2: 1 -2.5,0; 2 2.5,0
DISCRETE_SOD123 = smd 1.397 x 1.397: + -1.651,0; - 1.651,0
DO-214AC = smd 1.8 x 2.4: A 2.025,0; C -2.025,0
PH2.0WT-2PIN = smd 1 x 3: P$1 -1,0; P$2 1,0 | smd 1.5 x 3.5: P$3 -3.35,-5.7; P$4 3.35,-5.7
7.0-DAINRONG-50PIN-0.5MM = smd 0.3 x 1.5: P$1 -10.08,1.73; P$2 -9.58,1.73; P$3 -9.08,1.73; P$4 -8.58,1.73; P$5 -8.08,1.73; P$6 -7.58,1.73; P$7 -7.08,1.73; P$8 -6.58,1.73; P$9 -6.08,1.73; P$10 -5.58,1.73; P$11 -5.08,1.73; P$12 -4.58,1.73; P$13 -4.08,1.73; P$14 -3.58,1.73; P$15 -3.08,1.73; P$16 -2.58,1.73; P$17 -2.08,1.73; P$18 -1.58,1.73; P$19 -1.08,1.73; P$20 -0.58,1.73; P$21 -0.08,1.73; P$22 0.42,1.73; P$23 0.92,1.73; P$24 1.42,1.73; P$25 1.92,1.73; P$26 2.42,1.73; P$27 2.92,1.73; P$28 3.42,1.73; P$29 3.92,1.73; P$30 4.42,1.73; P$31 4.92,1.73; P$32 5.42,1.73; P$33 5.92,1.73; P$34 6.42,1.73; P$35 6.92,1.73; P$36 7.42,1.73; P$37 7.92,1.73; P$38 8.42,1.73; P$39 8.92,1.73; P$40 9.42,1.73; P$41 9.92,1.73; P$42 10.42,1.73; P$43 10.92,1.73; P$44 11.42,1.73; P$45 11.92,1.73; P$46 12.42,1.73; P$47 12.92,1.73; P$48 13.42,1.73; P$49 13.92,1.73; P$50 14.42,1.73 | smd 1.8 x 3: P$51 -12.58,-0.67; P$52 16.92,-0.67
KEVIN_3.0TYPEC-SMD = smd 0.3 x 1.7: A1 -3.35,0.5; A4 -2.55,0.5; A5 -1.25,0.5; A6 -0.25,0.5; A7 0.25,0.5; A8 1.25,0.5; A9 2.55,0.5; A12 3.35,0.5; B1 3.05,0.5; B4 2.25,0.5; B5 1.75,0.5; B6 0.75,0.5; B7 -0.75,0.5; B8 -1.75,0.5; B9 -2.25,0.5; B12 -3.05,0.5 | smd 1.143 x 2.921: P$6 -4.318,-0.762; P$7 4.318,-0.762 | smd 3.81 x 2.921: P$8 -4.318,-4.953; P$9 4.318,-4.953 | hole 0.68: -2.89,-1.22; 2.89,-1.22
2.54-8P-WOTIE = smd 1.25 x 3.5: 1 -8.839,-4.572; 2 -6.35,-4.572; 3 -3.81,-4.572; 4 -1.27,-4.572; 5 1.27,-4.572; 6 3.81,-4.572; 7 6.35,-4.572; 8 8.89,-4.572
CONNECTOR_4P-SMD-2.0-90D = smd 1.01 x 2.74: 1 -3,-0.1; 2 -1,-0.1; 3 1,-0.1; 4 3,-0.1 | smd 2.54 x 2.184: SS1 -5.5,7.4; SS2 5.5,7.4
157SW = smd 1.016 x 1.981: 1 0,0; 2 4,0
CD54_CD54 = smd 3 x 1.6: 1 0,2.159; 2 0,-2.159
CD32 = smd 3.5 x 1.6: 1 0,1.409; 2 0,-1.409
DISCRETE_LED-0603 = smd 0.762 x 0.889: + -0.762,0; - 0.762,0
FPC-6PIN-0.5MM = smd 0.3 x 1.5: 1 -1.31,2.184; 2 -0.81,2.184; 3 -0.31,2.184; 4 0.19,2.184; 5 0.69,2.184; 6 1.19,2.184 | smd 2 x 1.6: 7 -3.01,-0.496; 8 3.036,-0.496
SOT23-3 = smd 1.1 x 1.1: 1 -0.95,-1.016; 2 0.95,-1.016; 3 0,1.016
SOT-23 = smd 1.1 x 0.8: 1 1.2,-1; 2 1.2,1 | smd 1.1 x 0.9: 3 -1.2,0
SPARKFUN_SOT23 = smd 1 x 1.4: 1 -0.95,-1.1; 2 0.95,-1.1; 3 0,1.1
SOT23@1 = smd 1.016 x 1.143: 1 -0.95,-1.016; 2 0.95,-1.016; 3 0,1.016
DISCRETE_R0603 = smd 0.889 x 0.889: 1 -0.762,0; 2 0.762,0
R0603 = smd 0.889 x 0.889: 1 -0.762,0; 2 0.762,0
9P-SMD-W/-RING = smd 1.524 x 0.762: 1 0,4.4; 2 0,3.3; 3 0,2.2; 4 0,1.1; 5 0,0; 6 0,-1.1; 7 0,-2.2; 8 0,-3.3; 9 0,-4.4 | smd 1.524 x 1.016: G1 0.6,-5.746 | smd 2.032 x 1.524: G2 10.373,-5.4; G3 10.373,10 | smd 1.524 x 1.524: G4 0.392,9.181 | hole 0.889: 10.9,-2.6; 10.9,5.4
A_XBJ_SOT23-5 = smd 0.6 x 1: 1 -0.95,-1.2; 2 0,-1.2; 3 0.95,-1.2; 4 0.95,1.2; 5 -0.95,1.2
ESP32-S3 = smd 1.6 x 0.9: 1 0,18.01; 2 0,16.74; 3 0,15.47; 4 0,14.2; 5 0,12.93; 6 0,11.66; 7 0,10.39; 8 0,9.12; 9 0,7.85; 10 0,6.58; 11 0,5.31; 12 0,4.04; 13 0,2.77; 14 0,1.5; 27 18,1.5; 28 18,2.77; 29 18,4.04; 30 18,5.31; 31 18,6.58; 32 18,7.85; 33 18,9.12; 34 18,10.39; 35 18,11.66; 36 18,12.93; 37 18,14.2; 38 18,15.47; 39 18,16.74; 40 18,18.01 | smd 0.9 x 1.8: 15 2,0; 16 3.28,0; 17 4.55,0; 18 5.82,0; 19 7.09,0; 20 8.36,0; 21 9.63,0; 22 10.9,0; 23 12.17,0; 24 13.44,0; 25 14.71,0; 26 16,0 | smd 1 x 1: 41 7.64,11.16; 42 9.14,11.16; 43 6.14,11.16; 44 6.14,14.16; 45 7.64,12.66; 46 9.14,12.66; 47 7.64,14.16; 48 9.14,14.16; 49 6.14,12.66
SOT23-6 = smd 0.69 x 1.2: 1 -0.95,-1.3; 2 0,-1.3; 3 0.95,-1.3; 4 0.95,1.3; 5 0,1.3; 6 -0.95,1.3
LP3318_SOT23-5 = smd 0.6 x 1: 1 -0.95,-1.2; 2 0,-1.2; 3 0.95,-1.2; 4 0.95,1.2; 5 -0.95,1.2
SOP-16 = smd 0.66 x 1.5: 1 -4.445,-2.475; 2 -3.175,-2.475; 3 -1.905,-2.475; 4 -0.635,-2.475; 5 0.635,-2.475; 6 1.905,-2.475; 7 3.175,-2.475; 8 4.445,-2.475; 9 4.445,2.475; 10 3.175,2.475; 11 1.905,2.475; 12 0.635,2.475; 13 -0.635,2.475; 14 -1.905,2.475; 15 -3.175,2.475; 16 -4.445,2.475
NS4168-ESOP-8 = smd 1.6 x 0.5: 1 -2.8,1.905; 2 -2.8,0.635; 3 -2.8,-0.635; 4 -2.8,-1.905; 5 2.8,-1.905; 6 2.8,-0.635; 7 2.8,0.635; 8 2.8,1.905 | smd 2 x 3: 9 0,0
SOP23-5 = smd 1 x 0.635: 1 -1.27,1; 2 -1.27,0; 3 -1.27,-1; 4 1.27,-1; 5 1.27,1

### Placement (x,y rotation side)
C1  89.13,49.84 270 top
C2  103.44,86.38 270 top
C3  140.8,31.4 180 top
C4  10.64,35.13 180 top
C5  90.56,49.82 270 top
C6  159.21,37.23 180 top
C7  156.84,48.79 180 top
C8  156.82,47.12 180 top
C9  156.79,45.7 180 top
C10  130.89,32.99 90 top
C11  172.08,89.47 270 top
C12  147.12,20.06 90 top
C13  25.53,23.09 90 top
C14  42.59,20.42 180 top
C15  129.12,33.16 90 top
C16  42.6,14.4 180 top
C17  127.7,33.16 90 top
C18  91.77,56.66 90 top
C19  108.69,58.19 180 top
C20  148.62,20.06 270 top
C21  108.59,56.51 180 top
C22  91.99,49.79 90 top
C23  140.88,29.88 180 top
C24  50.08,17.22 0 top
C25  50.23,18.98 0 top
C26  145.97,65.68 180 top
C27  127.02,38.37 90 top
C28  127.11,43.91 270 top
C29  102.05,86.4 90 top
C30  73.65,86.94 270 top
C31  10.61,36.68 180 top
C32  10.71,38.4 180 top
C33  72.17,86.94 90 top
C34  121.31,43.91 90 top
C35  121.31,38.37 270 top
C36  131.9,62.39 90 top
C37  122.57,61.64 270 top
C38  42.6,19.05 180 top
C39  42.6,15.77 180 top
C40  118.2,38.12 90 top
C41  118.2,44.08 270 top
C42  159.2,35.4 180 top
C43  93.68,56.49 90 top
C44  119.3,61.55 270 top
C45  120.81,61.55 270 top
C46  133.45,62.25 90 top
C47  168.35,28.29 0 top
C48  168.35,30.14 0 top
C49  168.35,38.87 0 top
C50  168.44,37.19 180 top
C51  14.63,36.86 180 top
C54  145.68,20.06 90 top
D1  130.97,40.8 270 top
D2  114.84,37.53 90 top
D3  160.87,31.97 180 top
D4  114.84,44.67 90 top
D5  160.2,28.04 0 top
D6  102.34,49.8 0 top
J1  173.08,23.05 90 top
J2  90.16,42.54 0 top
J3  173.25,51.33 90 top
J4  146.26,97.67 0 top
J5  45.64,7.91 0 top
J6  38.49,94.14 0 top
J7  70.61,94.14 0 top
J10  102.47,94.07 0 top
K1  175.46,82.75 90 top
K4  175.56,68.33 90 top
L1  137.61,42.15 270 top
L2  127.44,56.09 270 top
L4  150.29,42.4 180 top
L5  96.9,56.05 0 top
LED1  177.36,36.52 270 top
P2  33.34,81.64 0 top
P4  128.27,94.51 0 top
Q1  123.92,38.37 270 top
Q2  123.92,43.91 270 top
Q3  159.53,24.17 90 top
Q4  70.49,61.64 0 top
Q5  99.5,61.44 90 top
Q6  76.96,61.64 90 top
Q9  161.21,80.12 0 top
Q10  157.35,80.12 0 top
Q30  91.72,61.39 0 top
R1  133.49,34.67 90 top
R2  134.84,34.67 270 top
R3  175.87,36.46 270 top
R4  26.24,15.16 180 top
R5  67.47,87.09 90 top
R6  119.88,43.91 270 top
R7  119.88,38.37 90 top
R8  168.09,50.58 180 top
R9  168.14,52.32 180 top
R10  50.08,15.78 180 top
R11  104.73,61.26 90 top
R12  26.26,17.98 180 top
R13  168.08,49.18 0 top
R14  168.14,53.71 180 top
R15  166,38.28 90 top
R16  153.09,20.06 270 top
R17  142.86,20.06 270 top
R18  170.41,89.47 90 top
R19  26.24,16.59 180 top
R20  156.77,44.28 0 top
R21  156.74,42.86 180 top
R22  26.26,19.43 180 top
R23  150.12,20.06 270 top
R24  144.25,20.06 270 top
R25  97.2,49.79 270 top
R26  79.9,49.96 270 top
R27  116.61,38.37 270 top
R28  116.61,43.91 90 top
R29  108.84,52.48 0 top
R30  124.5,61.55 90 top
R31  32.76,57.31 180 top
R32  83.3,49.95 90 top
R33  81.78,49.97 270 top
R34  84.61,49.9 90 top
R35  86.03,49.88 270 top
R36  93.36,49.76 90 top
R37  94.7,49.8 270 top
R38  87.63,49.84 270 top
R39  78.4,49.96 90 top
R40  26.22,91.54 0 top
R41  30.94,91.71 180 top
R42  30.96,90.2 180 top
R43  126.02,61.55 270 top
R44  164.99,26.69 180 top
R45  164.99,28.54 0 top
R46  14.55,38.54 180 top
R47  14.63,35.26 0 top
R48  73.85,61.64 270 top
R49  86.62,61.64 90 top
R50  50.08,14.35 180 top
R51  85.02,61.64 270 top
R52  83.51,61.64 270 top
R53  88.13,61.64 90 top
R54  81.75,61.64 90 top
R55  79.98,61.64 270 top
R56  67.38,61.64 270 top
R58  103.13,61.26 270 top
R67  151.64,20.06 270 top
R71  145.97,67.17 0 top
R72  146,68.6 0 top
R74  159.11,74.91 0 top
R75  159.2,76.67 180 top
R172  95.69,61.44 270 top
SD1  147.43,15.18 270 top
U1  157.12,40.15 270 top
U2  26.01,42.82 90 top
U3  129.21,61.97 0 top
U4  102.97,56.33 0 top
U5  138.36,36.44 270 top
U6  154.82,65.57 270 top
U11  34.19,17.22 0 top
U26  168.35,33.66 90 top
U$10  [7.0底框]  181.12,-0.19 0 bottom
U$15  [7.0板框]  -0.07,-0.1 0 top
U$30  [ELECROW-NEW]  67.97,67.16 0 top

### Tracks (layer width: path | path; a pad name or v marks a point on that pad's centre or on a via)
3V3  (via drill 0.35, 0.5)  (13 unrouted)
  Top 0.254: 69.17,86.41 v69.23,86.35 | v34.2,86.25 34.04,86.09 34.04,83.6 | P2.5 | P4.5 128.96,95.6 128.5,95.14 128.5,90.87 128.5,87.22 | v30.68,86.25 30.18,86.74 R41.2 30.18,94.24 33.2,97.25 38.32,97.25 39.49,96.08 J6.3 | R5.1 67.49,86.35 v69.23,86.35 | v69.23,86.35 69.23,88.22 71.61,90.59 J7.3 | C13.1 25.53,19.46 R22.2
  Top 0.3: R47.2 15.47,35.18 15.47,32.74 14.21,31.48 9.83,31.48
  Top 0.5: C32.2 9.83,40.49 9.27,40.97 U2.2 | 157.32,70.04 U6.16 155.73,70.01 155,69.28 155,67.18 154.02,66.2 U6.4 149.11,66.2 148.59,65.68 C26.1 | v69.23,86.35 72,86.35 C33.1 C30.2 | Q4.2 73.27,62.64 73.52,62.39
  Top 0.8: 73.97,86.21 74.99,87.22 120.18,87.22 | 53.44,15.77 R10.1 | SD1.4 148.53,13.71 | J10.3 103.44,93.94 C2.1 | 109.48,87.22 126.52,87.22 | 126.52,87.22 128.5,87.22 | 25.5,22.22 R22.2 | 136.68,66.76 120.18,66.76 109.42,66.76 75.82,66.76 Q4.2 71.44,62.89 67.87,62.89 R56.1 | 148.53,11.57 SD1.4 | SD1.4 | 162.05,17.87 162.22,18.04 173.48,18.04 175.83,20.39 175.83,35.65 R3.2 | 149.96,92.99 J4.6 150.07,87.79 149.54,87.26 | 126.52,87.22 139.76,87.22 139.96,87.42 | 139.96,87.42 139.96,93.05 J4.2 | 139.96,87.42 140.13,87.26 149.54,87.26 | 149.54,87.26 168.95,87.26 R18.1
  Top 1: 150.61,44.28 R20.1 156,48.74 C7.2 155.95,51.06 146.76,60.25 146.76,63.23 | C32.2 9.83,31.48 9.83,27.32 14.92,22.22 25.5,22.22 53.99,22.22 53.99,16.33 53.44,15.77 | 120.18,87.22 120.18,66.76 | 146.76,63.23 146.76,65.71 | 136.68,66.76 140.72,62.73 146.26,62.73 146.76,63.23 | R24.1 144.34,20.91 144.34,39.72 149.18,44.56 L4.2 | R24.1 R17.1 141.84,20.83 139.29,18.27 139.29,13.67 134.92,9.3 69.82,9.3 56.88,22.24 54.01,22.24 | R24.1 C54.2 C12.2 C20.1 R23.1 R67.1 R16.1 154.98,20.83 157.85,17.96 161.97,17.96 162.05,17.87 162.05,14.18 158.61,10.73 149.37,10.73 148.53,11.57
  Bottom 0.254: 35.63,86.25 v30.68,86.25
  Bottom 0.5: v69.23,86.35 69.23,86.25 35.63,86.25 v34.2,86.25
  pour Top (no thermals): 117.87,87.17 120.05,84.99 122.24,87.17
  pour Top (no thermals): 24.33,22.11 25.47,20.98 26.6,22.11
  pour Top (no thermals): 52.81,21.95 53.57,21.19 54.32,21.95
  pour Top (no thermals): 146.22,63.86 145.08,62.73 146.43,61.38 146.43,63.65
  pour Top (no thermals): 161.76,17.66 162.39,16.95 163.19,17.66
  pour Top (no thermals): 161.09,17.58 161.76,16.91 162.43,17.58
  pour Top (no thermals): 141.3,87.26 140.23,87.26 138.55,87.26
  pour Top (no thermals): 130.13,86.92 128.54,88.52 126.94,86.92
  pour Top (no thermals): 145.63,20.94 144.24,22.32 142.86,20.94
  pour Top (no thermals): 141.56,87.26 139.96,88.85 138.36,87.26
  pour Top (no thermals): 122.99,66.68 120.35,69.32 117.7,66.68
  pour Top (no thermals): 104.64,87.3 103.5,88.43 102.16,87.09 104.43,87.09
  pour Top (no thermals): 83.47,53.78 84.6,52.65 85.95,53.99 83.68,53.99
AVDD_10V  (via drill 0.35, 0.5)  (2 unrouted)
  Top 0.254: v122.9,40.71 v122.91,40.72 | 84.77,29.21 83.58,30.41 J2.P$8
  Top 0.5: C10.2 127.74,33.88 C17.2 v122.91,33.92 118.2,29.21 84.77,29.21 | Q1.1 v122.9,40.71
  Top 0.8: D1.2 130.97,33.91 R1.1
  Bottom 0.5: v122.91,40.72 v122.91,33.92
BAT+  (2 unrouted)
  Top 0.5: 169.35,30.45 169.24,30.34
  Top 0.8: U26.3 169.35,30.45
  Top 1: J1.P$1 169.24,22.05 C47.2 169.24,30.34 169.19,30.39 | 169.19,22.05 160.29,22.05 159.53,22.8 Q3.3 160.71,22.97 162.23,24.49 D5.A
D+
  Top 0.254: J3.A6 170.1,51.08 169.8,51.38 169.8,52.08 | J3.B6 169.8,52.08 | 169.8,52.08 169.14,52.08 R9.1
D-
  Top 0.254: R8.1 J3.B7 173.9,50.58 174.22,50.9 174.22,51.31 173.94,51.58 J3.A7
DCLK1
  Top 0.254: J2.P$14 86.58,47.88 87.7,49.01 R38.2 C1.2
DTR  (via drill 0.5)
  Top 0.5: U6.13 159.67,66.2 v159.7,66.17 | Q10.2 158.3,77.86 v158.27,77.84 158.27,76.83 R75.2
  Bottom 0.5: v158.27,77.84 159.79,76.32 159.79,66.27 v159.7,66.17
EN_RESET  (via drill 0.35)
  Top 0.254: 171.86,74.4 165.9,74.4 161.63,70.14 v161.63,61.72 | R54.2 81.75,63.57 v81.41,63.9
  Top 0.3: U2.3 10.54,44.48 v10.52,44.5 | v22.53,90.87 23.2,91.54 25.3,91.54 | 25.3,91.54 R40.1 | 170.12,90.24 161.17,99.18 30.51,99.18 25.3,93.98 25.3,91.54
  Top 0.5: 171.86,77.18 171.86,77.6 171.86,79.3 170.03,81.13 Q9.3 | 171.86,77.18 171.86,74.4 | 171.86,77.18 171.86,75.08 171.86,74.34 173.88,72.33 K4.2 177.26,74.03 177.26,88.26 175.29,90.24 174.57,90.24 | R18.2 C11.1 174.57,90.24 | 170.12,90.24 174.57,90.24 | U2.3 10.54,41.54 11.19,40.89 12.11,40.89 13.79,39.21 R46.2
  Bottom 0.254: v161.63,61.72 161.61,61.69 83.62,61.69 v81.41,63.9
  Bottom 0.3: v10.52,44.5 10.52,52.34 13.34,55.17 13.34,81.68 v22.53,90.87
GND  (via drill 0.35, 3.2 pad 5.2)
  Top 1: v8.99,64 8,63.01 U2.40 8,57.91 8.31,57.61 | 8.1,45.59 8,45.49 U2.1 8,27.66 8.38,27.28 | J3.P$7 J3.P$9 | J3.P$6 J3.P$8 | K1.1 172.09,82.75
  other vias: 177.6,100.46 3.6,100.46 3.6,3.47 177.6,3.48 22.75,76.03 111.93,85.2 146.39,32.86 62.6,27.05 13.98,33.52 172.27,42.64 23.99,88.23 95.78,5.31 61.25,16.24 113.26,55.51 115.41,100.45 15.26,77.33 117.33,47.97 167.67,26.67 80.05,94.99 170.65,54.43 119.04,34.62 11.52,33.64 150.96,100.9 95.58,91.1 9.33,77.09 153.19,46.85 152.64,30.35 9.99,3.36 16.11,11.91 110.06,36.95 36.44,71.24 39.7,9.44 101.94,62.4 170.53,57.14 111.03,56.17 160.68,3.36 117.44,25.67 145.12,100.87 159.36,46.7 67.17,70.13 15.23,19.82 171.31,55.95 159.18,43.43 27.97,83.56 107.93,96.97 122.63,47.94 104.71,100.95 159.16,15.09 28.6,99.94 166.42,75.8 105.65,70.2 76.35,94.64 65.94,8.51 146,17.61 168.37,8.33 137.55,97.72 110.23,73.63 135.24,25.28 58.91,9.42 135.04,5.26 82.77,64.09 166.57,55.53 73.62,78.76 133.71,37.25 165.5,16.18 120.76,47.93 164.78,55.11 114.94,30.68 88.22,100.95 170.69,42.7 125.5,88.78 57.73,101.01 81.85,94.85 135.25,21.21 165.92,3.33 131.36,78.24 8.49,29.07 87.75,70.32 104.71,41.5 148.53,17.82 167.56,25.55 9.02,66.41 39.77,13.89 12.62,32.72 77.19,55.29 172.28,40.82 166.82,60.39 171.99,57.37 149.04,30.38 158.92,16.48 76.93,84.02 113.72,34.38 63.51,33.21 163.52,48.96 136.11,32.25 121.52,34.54 120.23,96.37 154.09,32.2 24.55,96.36 7.89,40.83 17.56,40.78 15.9,40.9 166.06,69.83 25.7,30.7 20.61,92.83 63.91,78.58 48.43,25.78 80.07,100.71 54.87,61.42 115.2,5.27 119.01,48.03 154.42,29.71 34.36,13.16 9.08,45.64 9.25,48.4 9.05,51.83 7.99,57.11 9.24,58.51 100.93,56.35 102.46,53.63 104.64,53.71 110.98,60.85 59.29,83.51 68.95,101.06 169.14,78.52 101.48,52.49 99.69,56.35 25.61,38.09 16.59,3.25 15.4,80.65 8.73,19.24 8.53,24.01 28.35,21.11 9.01,68.73 170.95,27.56 8.98,71.08 172.27,25.73 9.05,73.94 23.43,3.58 8.06,36.92 142.18,25.44 39.58,20.6 148.79,53.46 30.3,21.11 150.03,49.64 167.11,19.83 172.32,27.58 47.7,14.08 147.53,25.45 47.59,17.16 146.47,37.28 47.74,15.42 52.48,19.87 50.57,20.7 146.28,7.84 164.81,9.63 159.29,44.99 154.3,16.4 159.36,47.92 154.58,12.81 150.46,12.91 96.11,84.42 58.29,96.9 156.34,73.44 153.89,88.8 152.64,73.54 113.31,54.26 115.99,73.24 168.48,56.19 17.14,89.73 160.3,60.46 171.59,81.88 165.33,82.72 166.28,65.87 168.42,58.23 85.52,84.28 70.87,83.61 46.45,96.99 21.6,58.35 55.08,40.77 113.11,22.32 9.07,11.53 153.53,42.39 159.65,41.71 128,11.2 86.35,65.32 126.48,11.16 110.18,33.69 116.6,30.66 135.56,65.13 109.82,11.29 154.38,41.31 56.77,20.03 147.68,24.26 9.6,80.31 15.28,70.86 133.7,51.85 154.5,55.89 172.24,45.25 169.07,45.23 170.73,45.21 169.06,42.75 171.77,46.8 171.61,16.28 97.26,11.04 49.75,70.48 26,88.57 50.07,83.4 88.19,47.12 164.68,79.98 19.32,57.84 28.12,61.75 47.54,61.37 39.8,61.41 22.76,54.73 23.94,55.99 7.92,38.54 49.76,33.59 49.67,29.81 101.08,32.64 8.01,47.17 27.83,60.11 16.83,24.04 18.3,38.66 74.02,58.82 83.11,52.13 105.35,84.77 39.98,97.15 52.79,27.32 59.38,37.99 46.22,31.35 25.74,28.02 12.79,86.28 9.43,100.56 11.45,93.5 16.99,98.79 52.12,79.24 29.61,70 44.64,83.19 28.85,94.87 20.28,87.31 112.87,69.7 116.4,83.73 125.05,83.47 135.55,80.62 148.53,77.22 137.78,77.9 128.54,78.32 148.44,83.36 152.73,83.78 167.6,85.37 140.01,69.61 115.14,91.03 107.11,90.96 111.84,96.88 157.44,100.96 169.43,101.57 136.25,88.71 146.42,88.88 156.92,93.42 160.45,89.97 164.31,88.8 132.03,59.62 112.96,47.94 108.42,34.92 125.39,50.55 132.82,88.9 128.33,47.86 135.3,55.92 59.87,24.59 150,70.62 147.73,70.62 148.91,69.7 135.55,74.4 141.35,64.83 166.25,63.36 166.76,57.4 165.78,98.19 146.84,97.28 163.38,44.69 166.91,42.78 147.68,52.32 148.52,63.75 165.65,31.61 170.63,23.52 169.45,19.86 171,25.26 133.78,38.54 150.58,30.31 136.89,29.55 161.26,40.97 150.51,36.18 154.62,42.82 159.45,49.42 115.44,47.91 104.25,52.49 88.88,46.27 90.9,46.19 93,46.19 93.84,19.73 122.48,31.23 62.71,61.38 109.81,45.21 62.68,4.39 38.19,3.64 109.44,60.81 98.86,62.91 109.11,49.73 106.84,49.05 105.24,45.53 85.92,52.25 97.35,62.75 93.82,54.26 81.6,52.38 117.2,19.84 87.37,19.96 58.47,18.03 148.53,47.79 145.59,48.54 146.42,56.75 128.7,50.45 101.15,20.38 78.37,4.73 84.59,65.52 59.5,61.45 25.62,35.4 24.44,35.57 19.53,72.44 19.11,69.16 43.05,78.99 44.56,91.09 83.78,47.26 84.12,46.08 22.66,62.84 117.24,41.22 120.6,41.14 125.05,41.22 135.13,37.27 124.83,35.35 136.52,34.13 132.57,31.44 128.96,31.02 126.27,31.11 128.37,35.98 119.17,63.48 120.77,63.48 123.63,63.73 124.63,63.57 127.15,60.88 125.64,52.81 129.25,59.62 129.42,52.31 90.39,39.63 91.57,40.81 165.74,34.11 164.9,35.87 164.74,38.31 151.87,22.62 112.65,40.63 8.07,59.35 9.07,55.9 8.15,54.22 8.04,44.69 8.24,50.09
  pour Top (rank 3): 0.02,104.06 181.12,104.06 181.12,-0.02 0.02,-0.02 0.02,26.98 7.49,26.98 7.49,76.64 0.02,76.64
  pour Bottom: 7.91,102.21 173.14,102.21 173.14,1.83 7.91,1.83
I2S_BCLK
  Top 0.3: U11.3 R19.1
I2S_CTRL
  Top 0.3: U11.1 27.33,19.13 R22.1
I2S_SDIN
  Top 0.3: U11.4 27.15,15.32 R4.1
IO0_BOOT_CLK  (via drill 0.35)
  Top 0.254: v42.52,81.12 24.51,63.11 U2.27 25.58,60.82 28.16,63.4 v30.09,63.4 | v147.18,81.38 153.06,81.38 155.92,84.23 157.35,84.23 172.97,84.23 175.46,86.72 K1.2 | v87.12,52.4 87.63,51.89 R38.1
  Top 0.5: Q10.3 157.35,84.23
  Bottom 0.254: v42.52,81.12 42.72,81.33 147.18,81.33 v147.18,81.38 | v30.09,63.4 30.17,63.48 72.59,63.48 82.92,53.15 86.37,53.15 v87.12,52.4
IO1_G7  (via drill 0.35)
  Top 0.254: v20.14,47.33 20.14,49.45 9.27,60.33 U2.39 | J2.P$31 95.08,37.82 94.3,37.04 94.3,34.93 v94.27,34.89
  Bottom 0.254: v94.27,34.89 94.18,34.97 80.63,34.97 68.27,47.33 v20.14,47.33
IO2_LCD_BL_CTR  (via drill 0.35)
  Top 0.254: v14.68,66.62 10.54,62.49 U2.38 | U4.4 105.04,57.63 106.28,58.87 106.28,61.3 105.55,62.02 R11.2 104.73,63.28 104.71,63.26 v104.71,63.19
  Bottom 0.254: v14.68,66.62 14.85,66.62 15.36,67.14 100.76,67.14 v104.71,63.19
IO3_G4  (via drill 0.35)
  Top 0.254: v90.99,32.91 90.99,36.25 93.58,38.84 J2.P$28
  Top 0.3: v27.64,45.07 v27.64,45.08 26.26,45.08 U2.15
  Bottom 0.3: v90.99,32.91 90.82,32.74 79.04,32.74 66.95,44.82 27.89,44.82 v27.64,45.07
IO4_B7  (via drill 0.35)
  Top 0.254: v96.17,35.69 96.17,36.19 99.08,39.11 J2.P$39
  Top 0.3: U2.4 11.89,42.9 11.89,44.71 14.34,47.17 v17.62,47.17
  Bottom 0.3: v17.62,47.17 18.71,47.17 20.74,49.2 67.96,49.2 81.47,35.69 v96.17,35.69
IO5_B6  (via drill 0.35)
  Top 0.254: J2.P$38 98.58,40.06 v98.3,39.78
  Top 0.3: U2.5 13.16,42.9 v13.16,44.21
  Bottom 0.3: v13.16,44.21 13.16,49.51 16.97,53.31 69.33,53.31 84.16,38.48 91.1,38.48 92.41,39.78 v98.3,39.78
IO6_B5  (via drill 0.35)
  Top 0.254: v97.59,38.98 97.59,42.35 98.08,42.84 J2.P$37
  Top 0.3: U2.6 14.43,42.9 14.43,44.17 v14.39,44.21
  Bottom 0.3: v14.39,44.21 14.3,44.29 14.3,49.67 17.13,52.5 69.07,52.5 83.64,37.92 91.54,37.92 92.59,38.98 v97.59,38.98
IO7_B4  (via drill 0.35)
  Top 0.254: v96.91,38.2 96.87,38.23 96.87,42.29 97.58,42.99 J2.P$36
  Top 0.3: v15.65,44.38 15.53,44.26 15.53,42.92 U2.7
  Bottom 0.3: v96.91,38.2 92.73,38.2 91.88,37.35 83.03,37.35 68.74,51.64 17.53,51.64 15.65,49.76 v15.65,44.38
IO8_G5  (via drill 0.35)
  Top 0.254: v21.95,44.23 21.97,44.21 U2.12 | v91.76,32.19 91.78,32.21 91.78,36.25 94.08,38.55 J2.P$29
  Bottom 0.3: v91.76,32.19 91.67,32.11 78.56,32.11 66.44,44.23 v21.95,44.23
IO9_G2  (via drill 0.35)
  Top 0.254: v89.18,34.26 89.18,36.44 92.58,39.84 J2.P$26
  Top 0.3: U2.17 28.21,47.37 v28.98,46.61
  Bottom 0.3: v89.18,34.26 89.09,34.34 80.14,34.34 68.13,46.35 28.98,46.35 v28.98,46.61
IO10_TF_CS  (via drill 0.35)
  Top 0.3: v67.47,22.04 66.71,22.8 66.71,43.49 61.55,48.64 U2.18 | SD1.2 150.6,15.31 150.6,16.52 151.52,17.44 v151.52,17.52 151.52,19.17 R67.2
  Bottom 0.254: v67.47,22.04 82.74,6.77 140.77,6.77 v151.52,17.52
IO11_TF_SPI_MOSI/TP_DIN  (via drill 0.35)  (1 unrouted)
  Top 0.3: R23.2 150.12,17.99 v150.15,17.96 149.82,17.62 149.82,14.73 | U2.19 63.1,49.91 67.75,45.26 67.75,22.96 v69.01,21.7
  Bottom 0.254: v150.15,17.96 140.19,8 82.71,8 v69.01,21.7
  Bottom 0.3: v69.01,21.7 69.04,21.7
IO12_TF_CLK/TP_CLK  (via drill 0.35)
  Top 0.3: U2.20 63.77,51.18 68.72,46.23 68.72,23.23 v70.32,21.64 | v147.43,16.61 SD1.5
  Bottom 0.254: v70.32,21.64 82.92,9.04 139.85,9.04 v147.43,16.61
IO13_TF_SPI_MISO/TP_OUT  (via drill 0.35)
  Top 0.3: R24.2 144.25,17.41 v144.41,17.41 144.41,17.26 145.23,16.44 SD1.7 | v70.36,22.93 70.36,46.53 64.44,52.45 U2.21
  Bottom 0.254: v70.36,22.93 83.3,9.99 137,9.99 v144.41,17.4 v144.41,17.41
IO14_R3  (via drill 0.35)
  Top 0.254: J2.P$19 89.08,43.35 87.86,42.13 v87.86,39.22
  Top 0.3: U2.22 26.29,53.44 28.39,53.44 v29.1,54.16
  Bottom 0.3: v87.86,39.22 87.82,39.26 84.41,39.26 69.52,54.16 v29.1,54.16
IO15_B3  (via drill 0.35)
  Top 0.254: v96.19,37.34 v96.18,37.35 96.18,42.24 97.08,43.14 J2.P$35
  Top 0.3: v16.73,44.53 16.82,44.43 16.82,42.89 U2.8
  Bottom 0.3: v96.19,37.34 92.85,37.34 92.33,36.82 82.5,36.82 68.57,50.75 18.57,50.75 16.73,48.9 v16.73,44.53
IO16_G6  (via drill 0.35)
  Top 0.254: v93.36,36.43 93.36,37.18 94.54,38.36 94.54,44.23 J2.P$30
  Top 0.3: U2.9 18.49,43.15 18.49,48.91 v18.36,49.04
  Bottom 0.3: v93.36,36.43 93.36,36.26 81.93,36.26 68.17,50.02 19.34,50.02 v18.36,49.04
IO17_I2S_SDIN  (via drill 0.35)
  Top 0.254: U2.10 19.43,40.76 21.29,38.9 v21.27,38.87 | v22.78,15.1 22.84,15.16 R4.2
  Bottom 0.254: v21.27,38.87 21.27,16.61 v22.78,15.1
IO18_I2S_LRCLK  (via drill 0.35)
  Top 0.254: U2.11 20.71,42.81 20.71,40.72 21.79,39.64 v22.37,39.64
  Top 0.3: R12.2 23.72,17.98 22.4,19.3 v22.4,20.9
  Bottom 0.3: v22.37,39.64 22.4,39.64 v22.4,20.9
IO19_I2C_SDA  (via drill 0.35)
  Top 0.254: v16.14,57.1 23.1,50.14 23.1,42.96 U2.13 | v18.35,65.44 18.35,65.37 26.73,73.75 27.82,73.75 32.53,78.46 P2.2 32.53,88.02 v34.46,89.94 37.48,92.97 37.48,94.31 37.49,94.3 J6.2 | P4.2 127.46,90.2 v127.45,90.19 | R41.1 31.91,91.91 31.94,91.88 v33.03,91.88 | v152.39,90.53 152.39,92.88 J4.7
  Bottom 0.254: v16.14,57.1 16.14,64.83 16.75,65.44 v18.35,65.44 | 34.5,89.99 127.25,89.99 v127.45,90.19 152.05,90.19 v152.39,90.53 | v34.46,89.94 34.5,89.99 | v33.03,91.88 33.03,91.54 34.5,90.07 34.5,89.99
IO20_I2C_SCL  (via drill 0.35)
  Top 0.254: v17.08,64 17.08,65.42 26.1,74.45 27.66,74.45 32.03,78.81 32.03,83.14 P2.1 32.03,89.89 R42.1 33.46,90.2 34.88,91.62 v34.88,91.71 35.21,91.71 35.46,91.96 35.46,94.31 35.38,94.4 35.38,94.15 J6.1 | v17.09,57.85 17.09,56.82 24.51,49.4 U2.14 | v125.43,92.13 126.18,92.13 126.96,92.9 P4.1 | v155.16,90.45 155.15,90.46 J4.8
  Bottom 0.254: v17.08,64 17.09,63.98 v17.09,57.85 | v34.88,91.71 35.33,92.16 125.4,92.16 v125.43,92.13 153.48,92.13 v155.16,90.45
IO21_R4  (via drill 0.35)
  Top 0.254: J2.P$20 89.58,43.17 88.55,42.15 88.55,40.01 v88.57,39.99
  Top 0.3: U2.23 27.47,54.99 v27.75,54.71
  Bottom 0.3: v88.57,39.99 84.62,39.99 69.65,54.96 27.99,54.96 v27.75,54.71
IO38_D  (1 unrouted)
  Top 0.254: U2.31 19.43,61.98 33.03,75.58 P2.3 33.03,87.43 35.38,89.78 61.59,89.78 65.71,93.89 67.61,93.89 | 67.61,93.89 J7.1 67.61,95.88 70.16,98.43 127.96,98.43 | 67.61,93.89 67.61,87.99 R5.2 | P4.3 127.96,98.26 127.96,98.43 | 145.08,92.46 145.08,96 142.65,98.43 127.96,98.43
IO39_HSYNC  (via drill 0.35)
  Top 0.254: v20.07,63.67 18.08,61.68 18.08,60.91 U2.32 | J2.P$40 99.58,43.13 99.79,42.92 v99.79,42.25
  Bottom 0.254: v99.79,42.25 98.61,42.25 94.1,46.76 94.1,50.46 90.9,53.66 83.85,53.66 73.33,64.17 20.57,64.17 v20.07,63.67
IO40_VSYNC  (via drill 0.35)
  Top 0.254: J2.P$41 100.08,45.36 99.66,45.78 96.27,45.78 v95.84,46.22 | v20.01,64.75 20.01,64.62 16.89,61.5 U2.33
  Bottom 0.254: v20.01,64.75 20.1,64.84 74.02,64.84 84.36,54.5 90.71,54.5 94.6,50.61 94.6,47.44 95.67,46.37 95.68,46.37 v95.84,46.22
IO41_DE  (via drill 0.35)
  Top 0.254: J2.P$42 100.58,42.76 100.83,42.51 v100.83,42.42 | U2.34 15.62,61.38 19.81,65.57 v21.24,65.57
  Bottom 0.254: v100.83,42.42 95.27,47.98 95.27,50.55 95.27,51.14 91.07,55.34 84.77,55.34 74.62,65.49 21.32,65.49 v21.24,65.57
IO42-I2S_BCLK  (via drill 0.35)
  Top 0.254: v21.14,46.37 21.14,49.75 14.01,56.88 14.01,60.49 U2.35 | R19.2 20.05,16.59 v20.04,16.6
  Bottom 0.3: v20.04,16.6 20.04,43.1 21.14,44.19 v21.14,46.37
IO45_R7  (via drill 0.35)
  Top 0.254: v29.21,57.34 29.24,57.31 R31.2 | v91.09,42.3 J2.P$23
  Top 0.3: U2.26 27.73,58.82 v29.21,57.34
  Bottom 0.3: v91.09,42.3 85.79,42.3 70.75,57.34 v29.21,57.34
IO46_G3  (via drill 0.35)
  Top 0.254: v90.22,33.52 90.22,36.38 93.08,39.23 J2.P$27
  Top 0.3: U2.16 26.75,46.1 26.84,46.2 v27.85,46.2
  Bottom 0.3: v27.85,46.2 28.52,45.53 67.63,45.53 79.64,33.52 v90.22,33.52
IO47_R5  (via drill 0.35)
  Top 0.254: v89.56,40.74 89.59,40.76 89.59,42.53 90.08,43.02 J2.P$21
  Top 0.3: U2.24 27.78,56.26 v27.78,56.01
  Bottom 0.254: v89.56,40.74 84.87,40.74 69.85,55.76
  Bottom 0.3: v27.78,56.01 28.03,55.76 69.85,55.76
IO48_R6  (via drill 0.35)
  Top 0.254: v90.4,41.51 90.38,41.53 90.38,42.59 90.58,42.79 J2.P$22
  Top 0.3: U2.25 27.63,57.53 v27.82,57.34
  Bottom 0.3: v90.4,41.51 85.13,41.51 70.11,56.53 28.71,56.53 27.91,57.34 v27.82,57.34
L/R
  Top 0.254: J2.P$12 85.58,48.17 R34.1 86.01,49.14 R35.2
LCD_LEDA  (2 unrouted)
  Top 0.5: U4.5 103,57.6 103,56.92 103.67,56.26 104.8,56.26 106.73,58.19 C19.2 107.83,58.16 C21.2 | D6.2 104.63,50.01 | 105.68,50.23 105.68,54.66 107.44,56.43 107.74,56.43 C21.2 | C21.2 110.81,53.52 110.81,49.71 105.37,44.27 J2.P$50 104.16,44.27
LCD_LEDK  (via drill 0.35)  (2 unrouted)
  Top 0.5: v104.89,55.02 104.88,55.03 U4.3 | v108.03,53.63 108.08,53.58 R29.1 108.08,48.71 105.8,46.43 103.92,46.43 103.33,45.84 103.33,43.72
  Bottom 0.5: v108.03,53.63 | v108.03,53.63 106.64,55.02 v104.89,55.02
LRCLK
  Top 0.3: U11.2 27.15,17.86 R12.1
N$1
  Top 0.3: R3.1 175.87,37.28 LED1.+
N$2
  Top 0.254: J2.P$45 102.08,46.18 100.78,47.48 98.51,47.48 98.04,47.94 97.2,48.78 R25.2
N$3
  Top 0.5: C14.1 43.37,20.4 C38.1 45,19.05 46.64,17.41 J5.P$2
N$4
  Top 0.254: R26.2 79.9,48.53 82.08,46.35 J2.P$5
N$5
  cutout Top: 100.31,45.09 99.3,45.09 99.3,46.18 100.31,46.18
  cutout Top: 97.2,50.97 97.2,45.09 96.78,45.09 96.78,50.97
  cutout Top: 151.38,18.46 150.38,18.46 150.38,19.55 151.38,19.55
  cutout Top: 152.9,18.54 151.89,18.54 151.89,19.64 152.9,19.64
  cutout Top: 144.16,18.46 143.15,18.46 143.15,19.55 144.16,19.55
N$6
  Top 0.5: U11.8 41.77,19.13 C38.2
N$7
  Top 0.5: U5.3 137.11,35.43 R1.2
  Top 1: R2.1 R1.2
N$8
  Top 0.5: U11.5 41.39,15.32 C39.2
N$9  (1 unrouted)
  Top 0.8: C28.2 127.11,39.21 C27.2
  Top 1: L1.2 134.53,43.07 127.19,43.07
  pour Top (rank 2): 136.6,45 129.88,45 129.29,44.42 129.29,42.06 129.71,41.64 132.06,41.64 136.6,37.11 137.61,37.11 137.61,44
N$10
  Top 1: C27.1 125.69,37.61 Q1.3
N$11
  Top 0.3: J3.A5 169.75,50.08 R13.2
N$12  (1 unrouted)
  Top 0.254: R37.2 94.7,48.62 96.97,46.35 99.98,46.35 101.07,45.26 J2.P$43 | R36.1 95,49
N$13
  Top 0.8: U1.3 155.9,39.22 151.32,39.22 L4.1
N$14
  Top 0.254: R39.1 78.4,49.11 81.58,45.94 J2.P$4
N$15
  Top 0.5: C39.1 C16.1 44.64,13.12 J5.P$1
N$16  (1 unrouted)
  Top 0.8: L5.2 97.29,55.03 U4.1 99.32,52.32 99.32,50.39
N$17
  Top 0.3: J3.B5 169.53,53.08 R14.1
N$18
  Top 0.5: U3.5 126.88,63.17 R43.1 R30.2
N$19
  Top 0.5: U3.3 130.16,56.65 L2.1
N$20
  Top 0.5: R20.2 157.53,42.88 | 157.53,42.88 R21.1 | U1.5 157.53,41.89 157.53,42.88
N$21  (via drill 0.35)
  Top 0.5: v164.24,25.6 v164.23,25.61 R44.2 R45.1 | Q3.1 160.53,26.36 v160.37,26.52
  Bottom 0.5: v164.24,25.6 163.31,26.52 v160.37,26.52
N$22
  Top 0.5: R15.1 166,36.29 U26.5
N$23  (1 unrouted)
  Top 0.8: Q5.1 104.73,60.49 R11.1
N$24
  Top 1: C28.1 125.69,44.67 Q2.3
N$26  (via drill 0.35)  (1 unrouted)
  Top 0.254: 85.28,60.87 85.28,60.46 v85.78,59.96 | v127.36,59.45 128.26,60.35 U3.1
  Top 0.8: R51.2 85.28,60.87 | 85.36,60.87 R49.1
  Bottom 0.254: v127.36,59.45 86.28,59.45 v85.78,59.96
N$27
  Top 0.5: Q6.3 75.1,60.87 R48.2 73.61,60.64 Q4.1
N$29  (2 unrouted)
  Top 0.8: Q1.2 122.73,37.59 119.9,37.59
N$30  (2 unrouted)
  Top 0.8: 122.73,44.69 119.9,44.69
  Top 1: Q2.1 122.73,44.69
N$31  (via drill 0.35)  (1 unrouted)
  Top 0.254: U5.4 138.95,34.87 v138.95,34.5 | v141.64,38.7 141.64,57.86 v141.47,58.02
  Top 0.8: R52.2 83.51,59.79 84.69,58.61 v85.86,58.61 86.86,58.61 | 86.79,58.61 88.13,59.96 R53.1
  Bottom 0.254: v141.47,58.02 141.36,57.91 86.56,57.91 v85.86,58.61 | v138.95,34.5 139.04,34.5 141.64,37.11 v141.64,38.7
N$32
  Top 0.5: Q9.1 160.26,76.98 R75.1
N$33
  Top 0.5: R54.1 R55.2 78.25,60.87 Q6.1
N$36
  Top 0.8: Q30.1 92.96,60.42 95.43,60.42 R172.2 97.63,60.68 Q5.3
N$38
  Top 0.5: Q10.1 156.4,76.03 157.52,74.91 R74.1
N$40
  Top 0.3: U6.2 152.2,68.59 R72.2
N$42
  Top 0.3: R71.2 146.98,67.41 152.29,67.41 U6.3
N$47
  Top 0.3: SD1.1 151.8,15.21 151.8,15.43 153.09,16.72 R16.2
N$48
  Top 0.3: SD1.8 144.13,16.49 142.86,17.76 R17.2
RESET  (via drill 0.35)
  Top 0.254: v129.46,92.92 P4.6 | v34.54,80.2 34.53,80.21 P2.6 | v28.32,91.56 28.32,91.54 R40.2 26.99,81.8 v28.63,80.15
  Bottom 0.254: v34.54,80.2 34.49,80.15 v28.63,80.15
  Bottom 0.3: v129.46,92.92 129.44,92.9 29.66,92.9 v28.32,91.56
RTS
  Top 0.5: Q9.2 161.97,78.91 161.97,76.25 160.62,74.91 R74.2 159.87,68.2 159.14,67.47 U6.14
TFT-3V3  (2 unrouted)
  Top 0.254: R36.2 93.36,50.94 | 90.62,50.52 C5.1 | J2.P$44 101.58,45.67 100.4,46.85 97.54,46.85 95.94,48.45 95.94,51.48 95.61,51.81 | 84.56,50.71 R34.2
  Top 0.5: 93.36,50.94 94.23,51.81 95.61,51.81 | 90.57,50.97 87.63,53.91 84.61,53.91 | R34.2 84.61,53.91 | 84.61,53.91 79.48,53.91 78.47,52.9 78.47,50.8 R39.2 77.04,50.72 67.38,60.38 R56.2
  Top 0.8: R36.2 90.62,50.52 | R32.2 84.56,50.71 | Q4.3 68.53,60.87 R56.2
TFT_RESET  (via drill 0.35)
  Top 0.254: J2.P$7 83.08,46.36 v82.42,47.02
  Top 0.3: v14.63,40.72 14.63,39.21 R46.1 15.31,36.94 C51.1 13.87,35.33 R47.1
  Bottom 0.254: v82.42,47.02 71.33,58.11 24.13,58.11 20.77,54.75 15.05,54.75 14.04,53.74
  Bottom 0.3: 14.04,53.74 11.98,51.68 11.98,43.37 v14.63,40.72
U/D
  Top 0.254: J2.P$11 85.08,47.33 83.3,49.1 R32.1 83.32,49.21 R33.2
UART0_RXD0  (via drill 0.35)
  Top 0.254: U2.36 13.08,62.5 18.06,67.48 v18.06,76.14 | R72.1 145.23,80.19 140.23,85.19 v125.47,85.19 | v99.47,88.22 J10.1
  Bottom 0.254: v18.06,76.14 30.14,88.22 v99.47,88.22 122.45,88.22 v125.47,85.19
UART0_TXD0  (via drill 0.35)
  Top 0.254: U2.37 11.81,62.33 16.84,67.35 v16.84,76.2 | R71.1 144.45,67.17 143.86,67.75 143.86,79.77 139.57,84.06 128.13,84.06 v128.06,84.13 | v101.49,89 101.47,89 J10.2
  Bottom 0.254: v16.84,76.2 16.84,76.7 29.14,89 v101.49,89 123.19,89 v128.06,84.13
USB_D+
  Top 0.254: U6.5 153.55,64.93 155.08,63.4 155.08,60.29 163.3,52.07 167.12,52.07 R9.2
USB_D-
  Top 0.254: U6.6 153.56,63.66 154.24,62.98 154.24,59.79 163.11,50.92 166.99,50.92 R8.2
VBUS  (4 unrouted)
  Top 0.5: D3.1 163.37,31.4 164.82,29.95 165.75,29.02 R45.2
  Top 0.6: 173.9,53.74 172.86,53.74 | 170.74,48.93 173.81,48.93
  Top 0.65: 173.9,53.74 175.54,52.09 175.54,50.66 173.81,48.93
  Top 1: 170.74,48.93 163.37,41.56 163.37,40.47 | D3.1 163.37,40.47 | 163.37,40.47 163.79,40.89 168.6,40.89 169.28,40.22 169.28,38.91 C49.2 169.24,37.24 C50.1 169.2,35.09 U26.4
  pour Top (no thermals): 163.1,40.09 163.65,39.54 164.99,40.89 163.9,40.89
  pour Top (no thermals): 164.53,43.03 163.4,41.9 164.74,40.55 164.74,42.82
VCOM  (via drill 0.35)  (1 unrouted)
  Top 0.5: L2.2 125.29,58.67 124.5,59.45 R30.1 124.46,60.75 C37.2 120.85,60.75 C45.2 C44.2 113.75,60.79 112.16,59.19 112.16,50.88 v111.99,50.88 | v97.46,52.31 97.04,51.89 97.2,51.72 R25.1 | 96.87,52.06 96.28,52.65 v90.23,52.65 | v79.82,52.14 79.9,52.06 R26.1
  Bottom 0.5: v111.99,50.88 98.8,50.88 97.46,52.23 v97.46,52.31 | v90.23,52.65 90.15,52.65 87.54,50.04 81.92,50.04 v79.82,52.14
VDD  (via drill 0.35)  (4 unrouted)
  Top 0.3: U11.6 37.8,16.59
  Top 0.5: U11.6 38.68,16.59 39.31,17.21 v39.51,17.21 | v47.36,18.98 49.17,18.98
  Top 0.8: R50.2 49.32,18.82
  Bottom 0.5: v39.51,17.21 45.6,17.21 v47.36,18.98
VGH+18V  (2 unrouted)
  Top 0.254: 84.6,44.29 J2.P$10 84.58,32.49 87.01,30.05 87.54,30.05
  Top 0.5: D2.- 113.67,39.18 112.58,38.09 112.58,31.56 111.06,30.05 87.54,30.05 87.12,30.05
  Top 0.8: R7.2 114.89,39.13
  Top 1: 114.89,39.13 D2.-
VGL-8.2V  (via drill 0.35 pad 0.55, 0.5)  (2 unrouted)
  Top 0.254: v85.11,30.39 85.11,30.47 84.08,31.5 J2.P$9
  Top 0.5: D4.+ 113.11,43.02 v113,42.9
  Top 0.8: R6.2 114.98,43.15
  Top 1: 114.98,43.15 D4.+
  Bottom 0.5: v113,42.9 112.31,42.21 107.41,42.21 95.59,30.39 v85.11,30.39
VIN  (via drill 0.35, 0.8, 0.8 pad 0.55)  (5 unrouted)
  Top 0.3: 158.94,32.77 158.94,32.15
  Top 0.5: U1.1 156.42,41.1 U1.4 | C46.2 133.24,63.35 | C36.2 131.88,63.17 | 130.07,63.17 U3.4
  Top 0.8: R172.1 95.5,62.39 95.38,62.39 93.02,62.39 | v56.63,14.26 50.94,14.26 R50.1 | R52.1 R51.1 85.02,63.23 85.61,63.82 91.91,63.82 92.92,62.81 Q30.2
  Top 1: 157.87,31.46 D3.2 158.43,31.99 | 158.35,31.96 158.43,31.99 | 158.43,31.99 158.69,32.07 158.94,32.15 | 158.35,31.96 158.35,39.08 | 139.56,41.95 U5.5 139.62,37.44 140.63,37.44 141.56,36.52 141.56,34.08 140.04,32.57 C3.2 140.04,28.7 v139.46,28.12 139.46,27.93 137.1,25.57 137.1,16.44 133.74,13.08 71.08,13.08 v69.74,14.43 | 139.56,41.95 L1.1 | 158.31,28.03 152.99,28.03 v152.91,28.11 | 95.38,62.39 97.99,65 128.92,65 130.16,63.76 U3.4 130.18,63.15 C36.2 131.92,63.14 C46.2 135.19,63.14 139.56,58.76 139.56,41.95 | Q30.2 93.02,62.39 | Q3.2 158.53,28.04 D5.C 158.35,28.21 158.35,31.96
  Bottom 1: 152.87,28.07 v152.91,28.11 139.47,28.11 v139.46,28.12 | 56.88,14.51 v56.63,14.26 56.8,14.43 v69.74,14.43
VIN2  (1 unrouted)
  Top 0.8: U4.6 97.08,57.63 L5.1 96.87,57.42 C18.2 90.52,58.68 Q30.3 89.51,62.4 R53.2 R49.2
(copper drawn outside any net)
  shapes: Top area x2

### Text on the board
tPlace: www.elecrow.com | V2.0
tNames: J4 | GND | 3V3 | NC | IO38 | GND | 3V3 | IO19_SDA | IO20_SCL | IO20_SCL | IO19_SDA | 3V3 | GND | IO38 | NC | 3V3 | GND | IO44-RX0 | IO43-TX0 | 3V3 | GND | 6 | 1 | 6 | 1 | GND | 5V | 50 | 1 | - | + | I2S-CTRL | IO18-I2S-LRCLK | IO42-I2S-BCLK | VON- | VOP+ | IO17-I2S-SDIN
tStop: ESP32 Display-7 Inch | SKU:DIS08070H